# EAGLE design A-14732-40023-REPRODUCTION (EAGLE 7.4.0)

## Sheet 1 of 4
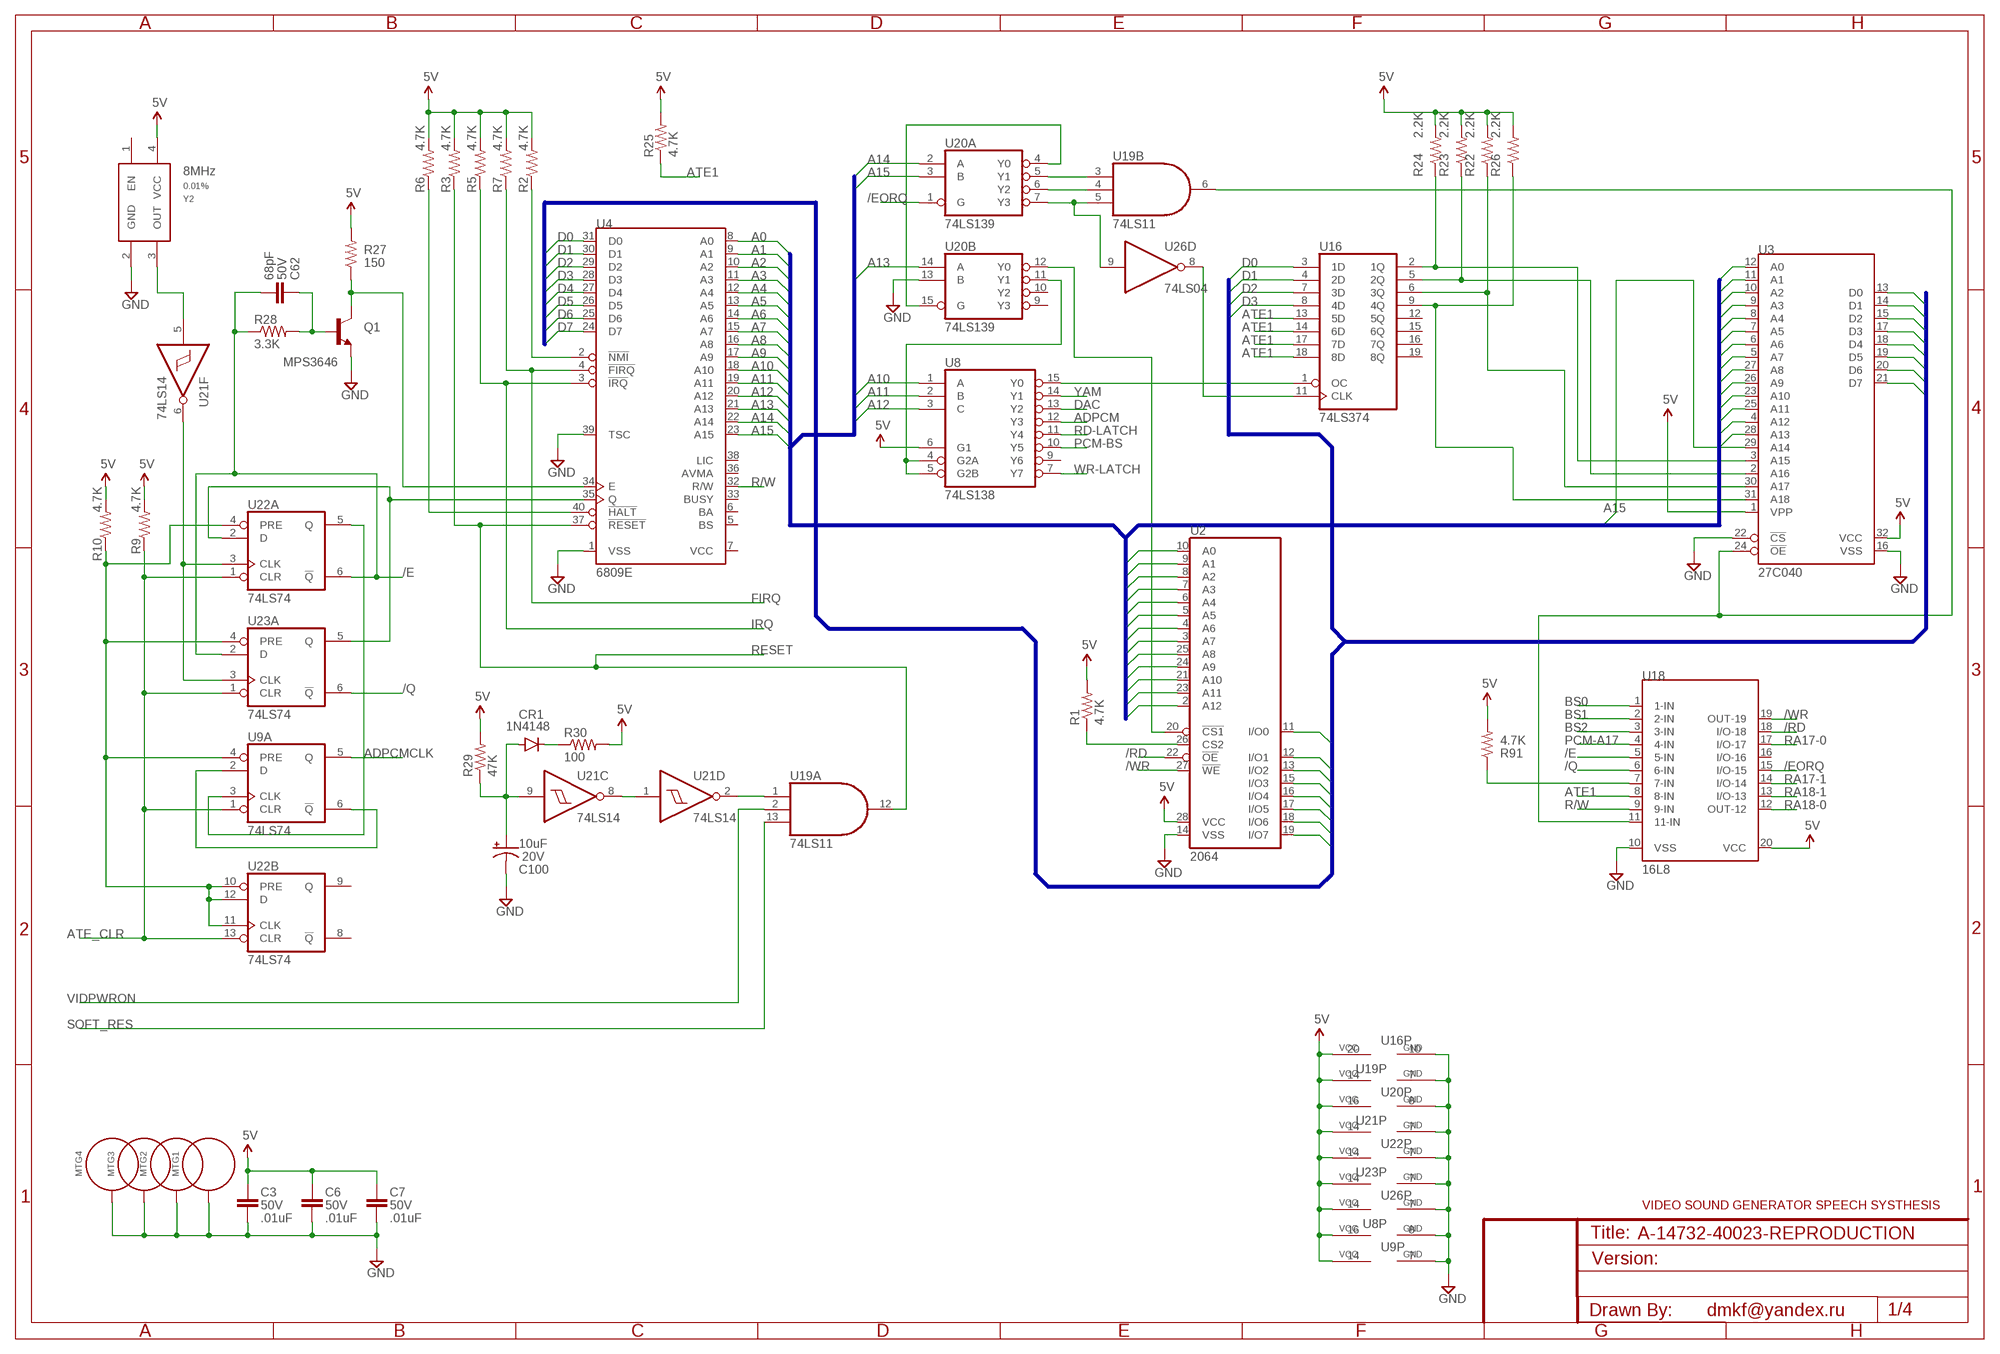
[diagram p0: schematic, sheet 1]

### Parts
C3  .01uF  CAP0805  [0805]
C6  .01uF  CAP0805  [0805]
C7  .01uF  CAP0805  [0805]
C62  68pF  CAP0805  [0805]
C100  10uF  CAP_POLC  [PANASONIC_C]
CR1  1N4148  DIODESMA  [SMA-DIODE]
MTG1  MTGHOLE  STANDOFF_ELECTRICAL  [STANDOFF-ELECTRICAL]
MTG2  MTGHOLE  STANDOFF_ELECTRICAL  [STANDOFF-ELECTRICAL]
MTG3  MTGHOLE  STANDOFF_ELECTRICAL  [STANDOFF-ELECTRICAL]
MTG4  MTGHOLE  STANDOFF_ELECTRICAL  [STANDOFF-ELECTRICAL]
Q1  MPS3646  TRANSISTOR_NPNMMBT2222A  [SOT23-3]
R1  4.7K  RESISTOR0805-RES  [0805]
R2  4.7K  RESISTOR0805-RES  [0805]
R3  4.7K  RESISTOR0805-RES  [0805]
R5  4.7K  RESISTOR0805-RES  [0805]
R6  4.7K  RESISTOR0805-RES  [0805]
R7  4.7K  RESISTOR0805-RES  [0805]
R9  4.7K  RESISTOR0805-RES  [0805]
R10  4.7K  RESISTOR0805-RES  [0805]
R22  2.2K  RESISTOR0805-RES  [0805]
R23  2.2K  RESISTOR0805-RES  [0805]
R24  2.2K  RESISTOR0805-RES  [0805]
R25  4.7K  RESISTOR0805-RES  [0805]
R26  2.2K  RESISTOR0805-RES  [0805]
R27  150  RESISTOR1206  [1206]
R28  3.3K  RESISTOR0805-RES  [0805]
R29  47K  RESISTOR0805-RES  [0805]
R30  100  RESISTOR1206  [1206]
R91  4.7K  RESISTOR0805-RES  [0805]
U2  2064  MS6264LSOP28  [SOP28]
U3  27C040  27C040PLCC32  [PLCC32R]
U4  6809E  [DIP40]
U8  74LS138  74LS138D  [SO16]
U9  74LS74  74LS74D  [SO14]
U16  74LS374  74LS374DW  [SO20W]
U18  16L8  PAL16L8  [DIP20N]
U19  74LS11  74LS11D  [SO14]
U20  74LS139  74LS139D  [SO16]
U21  74LS14  74LS14D  [SO14]
U22  74LS74  74LS74D  [SO14]
U23  74LS74  74LS74D  [SO14]
U26  74LS04  74LS04D  [SO14]
Y2  8MHz  OSCILLATOR5X3-PIN1-INDICATED  [CRYSTAL-OSC-SMD-5X3]

### Nets
5V: C3.1 C6.1 C7.1 R1.2 R2.2 R3.2 R5.2 R6.2 R7.2 R9.2 R10.2 R22.2 R23.2 R24.2 R25.2 R26.2 R27.2 R29.2 R30.2 R91.2 U2.28(VCC) U3.1(VPP) U3.32(VCC) U8.6(G1) U8.16(VCC) U9.14(P:VCC) U16.20(VCC) U18.20(VCC) U19.14(P:VCC) U20.16(P:VCC) U21.14(P:VCC) U22.14(P:VCC) U23.14(P:VCC) U26.14(P:VCC) Y2.4(VCC) ; also sheet 2,3,4
/E: C62.1 R28.1 U18.5(5-IN) U22.6(A:!Q) U23.2(A:D)
/EORQ: U18.15(I/O-15) U20.1(A:G)
/Q: U18.6(6-IN) U23.6(A:!Q)
/RD: U2.22(!OE) U18.18(I/O-18) ; also sheet 2
/WR: U2.27(!WE) U18.19(OUT-19) ; also sheet 2
A0: U2.10(A0) U3.12(A0) U4.8(A0) ; also sheet 2
A1: U2.9(A1) U3.11(A1) U4.9(A1)
A2: U2.8(A2) U3.10(A2) U4.10(A2)
A3: U2.7(A3) U3.9(A3) U4.11(A3)
A4: U2.6(A4) U3.8(A4) U4.12(A4)
A5: U2.5(A5) U3.7(A5) U4.13(A5)
A6: U2.4(A6) U3.6(A6) U4.14(A6)
A7: U2.3(A7) U3.5(A7) U4.15(A7)
A8: U2.25(A8) U3.27(A8) U4.16(A8)
A9: U2.24(A9) U3.26(A9) U4.17(A9)
A10: U2.21(A10) U3.23(A10) U4.18(A10) U8.1(A)
A11: U2.23(A11) U3.25(A11) U4.19(A11) U8.2(B)
A12: U2.2(A12) U3.4(A12) U4.20(A12) U8.3(C)
A13: U3.28(A13) U4.21(A13) U20.14(B:A)
A14: U4.22(A14) U20.2(A:A)
A15: U3.29(A14) U4.23(A15) U20.3(A:B)
ADPCM: U8.12(Y3) ; also sheet 2
ADPCMCLK: U9.5(A:Q) ; also sheet 2
ATE1: R25.1 U16.13(5D) U16.14(6D) U16.17(7D) U16.18(8D) U18.8(8-IN) ; also sheet 2,4
ATE_CLR: R9.1 U9.1(A:CLR) U22.1(A:CLR) U22.13(B:CLR) U23.1(A:CLR) ; also sheet 2
BS0: U18.1(1-IN) ; also sheet 2
BS1: U18.2(2-IN) ; also sheet 2
BS2: U18.3(3-IN) ; also sheet 2
D0: U2.11(I/O0) U3.13(D0) U4.31(D0) U16.3(1D) ; also sheet 2,4
D1: U2.12(I/O1) U3.14(D1) U4.30(D1) U16.4(2D) ; also sheet 2,4
D2: U2.13(I/O2) U3.15(D2) U4.29(D2) U16.7(3D) ; also sheet 2,4
D3: U2.15(I/O3) U3.17(D3) U4.28(D3) U16.8(4D) ; also sheet 2,4
D4: U2.16(I/O4) U3.18(D4) U4.27(D4) ; also sheet 2,4
D5: U2.17(I/O5) U3.19(D5) U4.26(D5) ; also sheet 2,4
D6: U2.18(I/O6) U3.20(D6) U4.25(D6) ; also sheet 2,4
D7: U2.19(I/O7) U3.21(D7) U4.24(D7) ; also sheet 2,4
DAC: U8.13(Y2) ; also sheet 2
FIRQ: R7.1 U4.4(!FIRQ) ; also sheet 2
GND: C3.2 C6.2 C7.2 C100.- MTG1.P1 MTG2.P1 MTG3.P1 MTG4.P1 Q1.2(E) U2.14(VSS) U3.16(VSS) U3.22(!CS) U4.1(VSS) U4.39(TSC) U8.8(GND) U9.7(P:GND) U16.10(GND) U18.10(VSS) U19.7(P:GND) U20.8(P:GND) U20.13(B:B) U21.7(P:GND) U22.7(P:GND) U23.7(P:GND) U26.7(P:GND) Y2.2(GND) ; also sheet 2,3,4
IRQ: R5.1 U4.3(!IRQ) ; also sheet 4
N$1: U21.5(F:I) Y2.3(OUT)
N$2: U21.6(F:O) U22.3(A:CLK) U23.3(A:CLK)
N$3: C62.2 Q1.1(B) R28.2
N$4: U9.3(A:CLK) U22.5(A:Q)
N$5: U4.35(Q) U22.2(A:D) U23.5(A:Q)
N$6: U9.2(A:D) U9.6(A:!Q)
N$7: Q1.3(C) R27.1 U4.34(E)
N$8: R10.1 U9.4(A:PRE) U22.4(A:PRE) U22.10(B:PRE) U22.11(B:CLK) U22.12(B:D) U23.4(A:PRE)
N$9: R6.1 U4.40(!HALT)
N$10: U20.4(A:Y0) U20.15(B:G)
N$11: R2.1 U4.2(!NMI)
N$12: U8.4(G2A) U8.5(G2B) U20.11(B:Y1)
N$13: U19.3(B:I0) U20.5(A:Y1)
N$14: C100.+ CR1.A R29.1 U21.9(C:I)
N$15: CR1.C R30.1
N$16: U21.1(D:I) U21.8(C:O)
N$17: U19.4(B:I1) U20.6(A:Y2)
N$18: U19.5(B:I2) U20.7(A:Y3) U26.9(D:I)
N$19: U19.1(A:I0) U21.2(D:O)
N$20: U8.15(Y0) U16.1(OC)
N$21: U16.11(CLK) U26.8(D:O)
N$22: U2.20(!CS1) U20.12(B:Y0)
N$23: R1.1 U2.26(CS2)
N$24: U3.24(!OE) U18.11(11-IN) U19.6(B:O)
N$25: R24.1 U3.3(A15) U16.2(1Q)
N$26: R23.1 U3.2(A16) U16.5(2Q)
N$27: R22.1 U3.30(A17) U16.6(3Q)
N$29: R26.1 U3.31(A18) U16.9(4Q)
N$30: R91.1 U18.7(7-IN)
PCM-A17: U18.4(4-IN) ; also sheet 2
PCM-BS: U8.10(Y5) ; also sheet 2
R/W: U4.32(R/W) U18.9(9-IN)
RA17-0: U18.17(I/O-17) ; also sheet 2
RA17-1: U18.14(I/O-14) ; also sheet 2
RA18-0: U18.12(OUT-12) ; also sheet 2
RA18-1: U18.13(I/O-13) ; also sheet 2
RD-LATCH: U8.11(Y4) ; also sheet 4
RESET: R3.1 U4.37(!RESET) U19.12(A:O) ; also sheet 2
SOFT_RES: U19.13(A:I2) ; also sheet 4
VIDPWRON: U19.2(A:I1) ; also sheet 4
WR-LATCH: U8.7(Y7) ; also sheet 4
YAM: U8.14(Y1) ; also sheet 2
Unconnected: U4.5(BS) U4.6(BA) U4.7(VCC) U4.33(BUSY) U4.36(AVMA) U4.38(LIC) U8.9(Y6) U16.12(5Q) U16.15(6Q) U16.16(7Q) U16.19(8Q) U18.16(I/O-16) U20.9(B:Y3) U20.10(B:Y2) U21.3(E:I) U21.4(E:O) U21.10(B:O) U21.11(B:I) U21.12(A:O) U21.13(A:I) U22.8(B:!Q) U22.9(B:Q) Y2.1(EN)

### Buses
D[0..7]
A[0..15]

### Notes on the sheet
- VIDEO SOUND GENERATOR SPEECH SYSTHESIS
- dmkf@yandex.ru

## Sheet 2 of 4
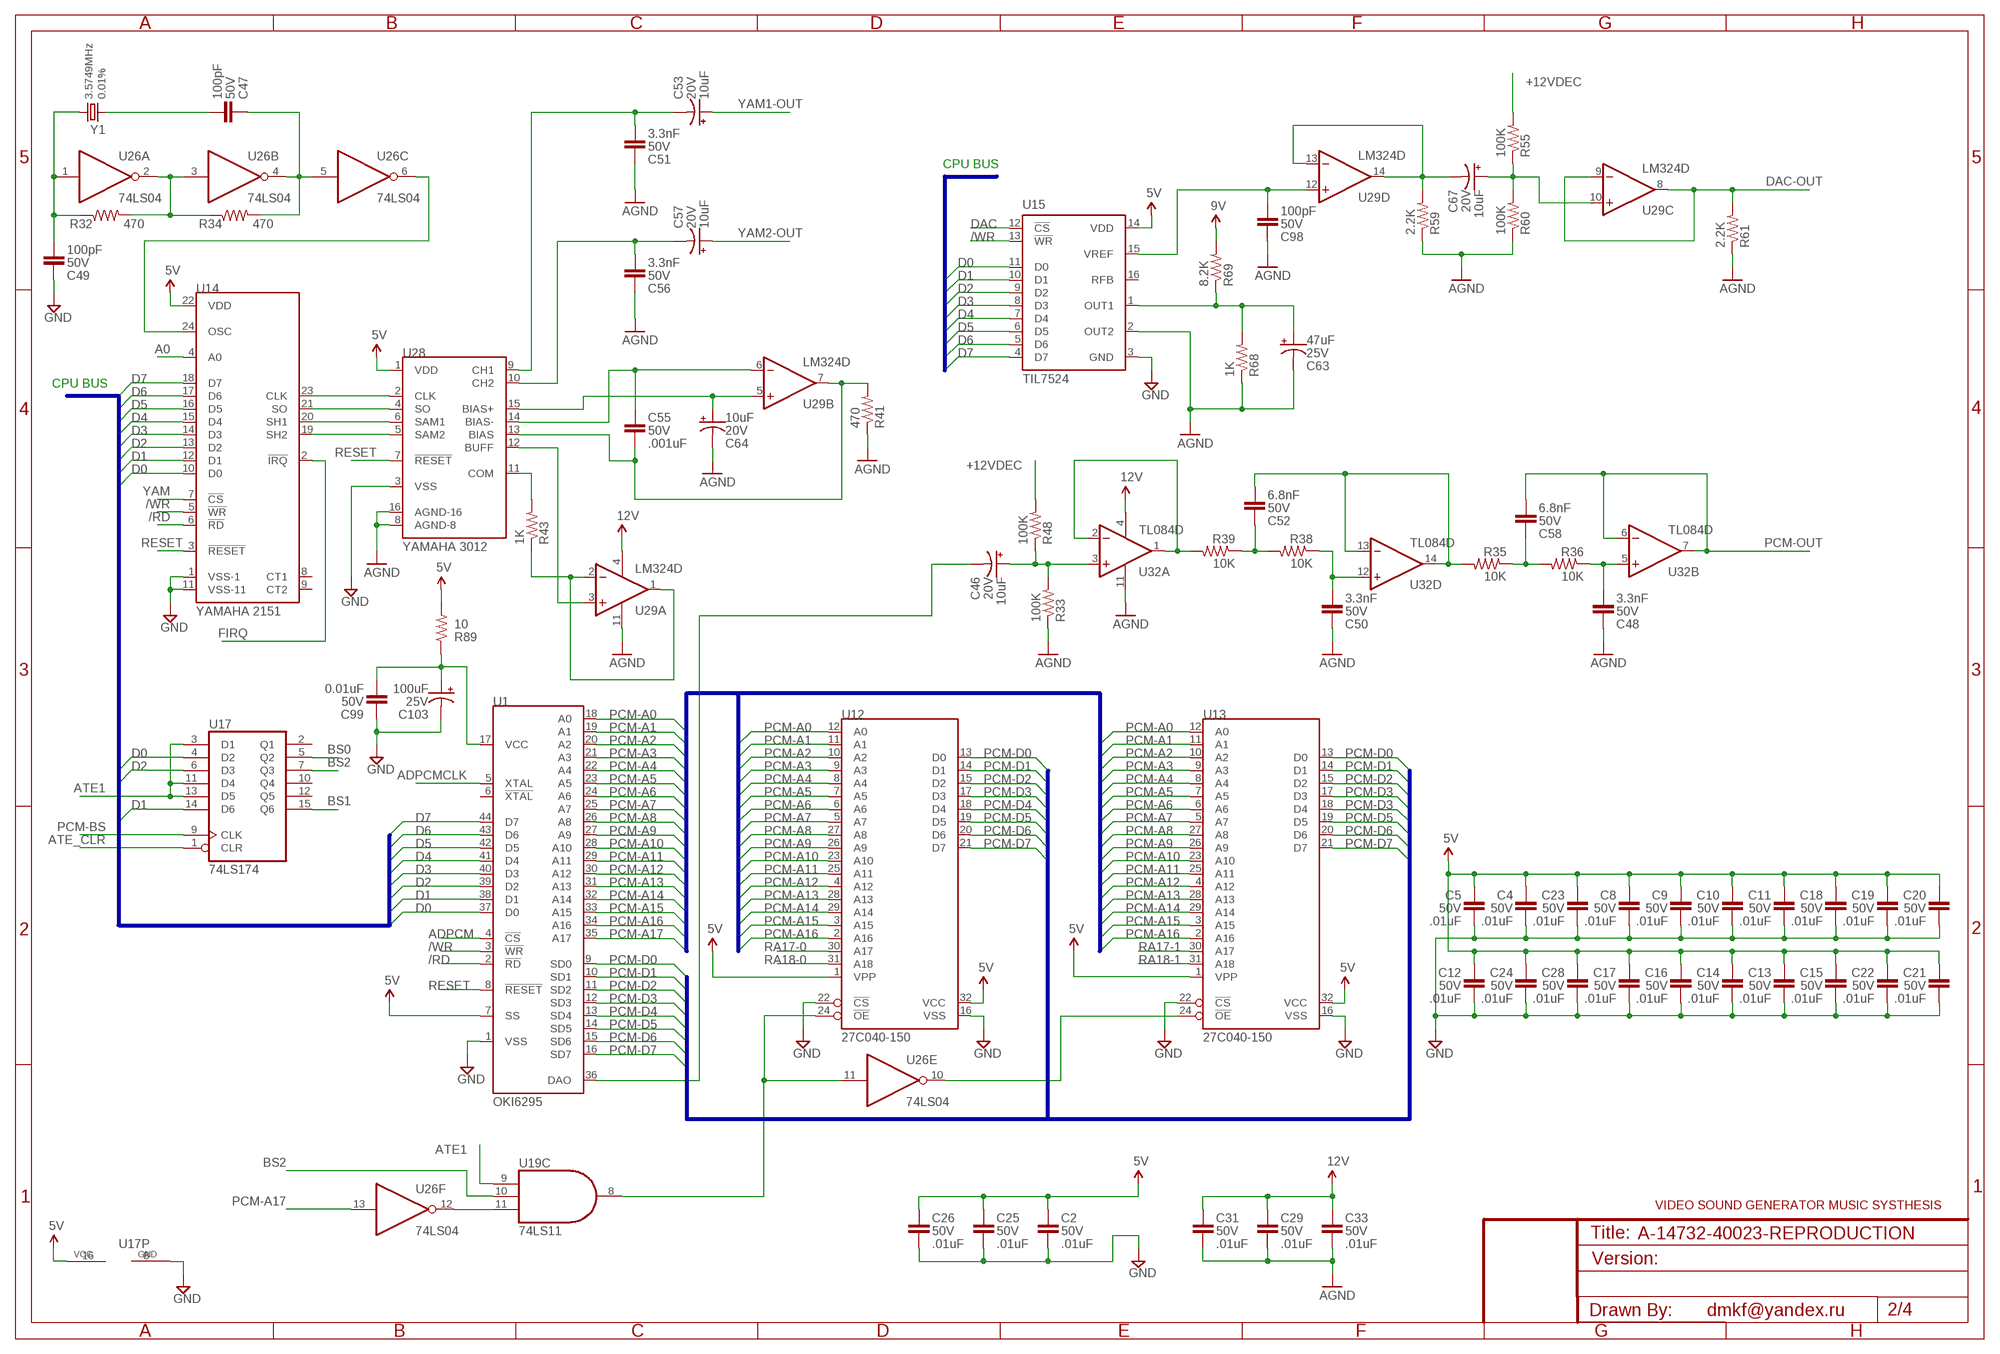
[diagram p1: schematic, sheet 2]

### Parts
C2  .01uF  CAP0805  [0805]
C4  .01uF  CAP0805  [0805]
C5  .01uF  CAP0805  [0805]
C8  .01uF  CAP0805  [0805]
C9  .01uF  CAP0805  [0805]
C10  .01uF  CAP0805  [0805]
C11  .01uF  CAP0805  [0805]
C12  .01uF  CAP0805  [0805]
C13  .01uF  CAP0805  [0805]
C14  .01uF  CAP0805  [0805]
C15  .01uF  CAP0805  [0805]
C16  .01uF  CAP0805  [0805]
C17  .01uF  CAP0805  [0805]
C18  .01uF  CAP0805  [0805]
C19  .01uF  CAP0805  [0805]
C20  .01uF  CAP0805  [0805]
C21  .01uF  CAP0805  [0805]
C22  .01uF  CAP0805  [0805]
C23  .01uF  CAP0805  [0805]
C24  .01uF  CAP0805  [0805]
C25  .01uF  CAP0805  [0805]
C26  .01uF  CAP0805  [0805]
C28  .01uF  CAP0805  [0805]
C29  .01uF  CAP0805  [0805]
C31  .01uF  CAP0805  [0805]
C33  .01uF  CAP0805  [0805]
C46  10uF  CAP_POLC  [PANASONIC_C]
C47  100pF  CAP0805  [0805]
C48  3.3nF  CAP0805  [0805]
C49  100pF  CAP0805  [0805]
C50  3.3nF  CAP0805  [0805]
C51  3.3nF  CAP0805  [0805]
C52  6.8nF  CAP0805  [0805]
C53  10uF  CAP_POLC  [PANASONIC_C]
C55  .001uF  CAP0805  [0805]
C56  3.3nF  CAP0805  [0805]
C57  10uF  CAP_POLC  [PANASONIC_C]
C58  6.8nF  CAP0805  [0805]
C63  47uF  CAP_POLD  [PANASONIC_D]
C64  10uF  CAP_POLC  [PANASONIC_C]
C67  10uF  CAP_POLC  [PANASONIC_C]
C98  100pF  CAP0805  [0805]
C99  0.01uF  CAP0805  [0805]
C103  100uF  CAP_POLD  [PANASONIC_D]
R32  470  RESISTOR0805-RES  [0805]
R33  100K  RESISTOR0805-RES  [0805]
R34  470  RESISTOR0805-RES  [0805]
R35  10K  RESISTOR0805-RES  [0805]
R36  10K  RESISTOR0805-RES  [0805]
R38  10K  RESISTOR0805-RES  [0805]
R39  10K  RESISTOR0805-RES  [0805]
R41  470  RESISTOR0805-RES  [0805]
R43  1K  RESISTOR0805-RES  [0805]
R48  100K  RESISTOR0805-RES  [0805]
R55  100K  RESISTOR0805-RES  [0805]
R59  2.2K  RESISTOR0805-RES  [0805]
R60  100K  RESISTOR0805-RES  [0805]
R61  2.2K  RESISTOR0805-RES  [0805]
R68  1K  RESISTOR0805-RES  [0805]
R69  8.2K  RESISTOR0805-RES  [0805]
R89  10  RESISTOR1206  [1206]
U1  OKI6295  [QFP44]
U12  27C040-150  27C040PLCC32  [PLCC32R]
U13  27C040-150  27C040PLCC32  [PLCC32R]
U14  YAMAHA 2151  YM2151  [DIP24]
U15  TIL7524  AD7524JR  [SOIC16N]
U17  74LS174  74LS174D  [SO16]
U28  YAMAHA 3012  YM3012  [DIP16N]
U29  LM324D  [SO14]
U32  TL084D  [SO14]
Y1  3.5749MHz  CRYSTALHC49U-V  [HC49U-V]

### Nets
5V: C2.1 C4.1 C5.1 C8.1 C9.1 C10.1 C11.1 C12.1 C13.1 C14.1 C15.1 C16.1 C17.1 C18.1 C19.1 C20.1 C21.1 C22.1 C23.1 C24.1 C25.1 C26.1 C28.1 R69.2 R89.2 U1.7(SS) U12.1(VPP) U12.32(VCC) U13.1(VPP) U13.32(VCC) U14.22(VDD) U15.14(VDD) U17.16(VCC) U28.1(VDD) ; supply symbol labelled 9V ; also sheet 1,3,4
12V: C29.1 C31.1 C33.1 U29.4(P:V+) U32.4(P:V+) ; also sheet 3
+12VDEC: R48.2 R55.2 ; also sheet 3
/RD: U1.2(!RD) U14.6(!RD) ; also sheet 1
/WR: U1.3(!WR) U14.5(!WR) U15.13(!WR) ; also sheet 1
A0: U14.4(A0) ; also sheet 1
ADPCM: U1.4(!CS) ; also sheet 1
ADPCMCLK: U1.5(XTAL) ; also sheet 1
AGND: C29.2 C31.2 C33.2 C48.2 C50.2 C51.2 C56.2 C63.- C64.- C98.2 R33.1 R41.1 R59.1 R60.1 R61.1 R68.1 U15.2(OUT2) U28.8(AGND-8) U28.16(AGND-16) U29.11(P:V-) U32.11(P:V-) ; also sheet 3
ATE1: U17.3(D1) U17.11(D4) U17.13(D5) U19.9(C:I0) ; also sheet 1,4
ATE_CLR: U17.1(CLR) ; also sheet 1
BS0: U17.5(Q2) ; also sheet 1
BS1: U17.15(Q6) ; also sheet 1
BS2: U17.7(Q3) U19.10(C:I1) ; also sheet 1
D0: U1.37(D0) U14.10(D0) U15.11(D0) U17.4(D2) ; also sheet 1,4
D1: U1.38(D1) U14.12(D1) U15.10(D1) U17.14(D6) ; also sheet 1,4
D2: U1.39(D2) U14.13(D2) U15.9(D2) U17.6(D3) ; also sheet 1,4
D3: U1.40(D3) U14.14(D3) U15.8(D3) ; also sheet 1,4
D4: U1.41(D4) U14.15(D4) U15.7(D4) ; also sheet 1,4
D5: U1.42(D5) U14.16(D5) U15.6(D5) ; also sheet 1,4
D6: U1.43(D6) U14.17(D6) U15.5(D6) ; also sheet 1,4
D7: U1.44(D7) U14.18(D7) U15.4(D7) ; also sheet 1,4
DAC: U15.12(!CS) ; also sheet 1
DAC-OUT: R61.2 U29.8(C:OUT) U29.9(C:-IN) ; also sheet 3
FIRQ: U14.2(!IRQ) ; also sheet 1
GND: C2.2 C4.2 C5.2 C8.2 C9.2 C10.2 C11.2 C12.2 C13.2 C14.2 C15.2 C16.2 C17.2 C18.2 C19.2 C20.2 C21.2 C22.2 C23.2 C24.2 C25.2 C26.2 C28.2 C49.2 C99.2 C103.- U1.1(VSS) U12.16(VSS) U12.22(!CS) U13.16(VSS) U13.22(!CS) U14.1(VSS-1) U14.11(VSS-11) U15.3(GND) U17.8(GND) U28.3(VSS) ; also sheet 1,3,4
N$34: C49.1 R32.1 U26.1(A:I) Y1.1
N$35: R32.2 R34.1 U26.2(A:O) U26.3(B:I)
N$36: C47.2 R34.2 U26.4(B:O) U26.5(C:I)
N$37: C47.1 Y1.2
N$38: U14.24(OSC) U26.6(C:O)
N$40: U14.23(CLK) U28.2(CLK)
N$41: U14.21(SO) U28.4(SO)
N$42: U14.20(SH1) U28.6(SAM1)
N$43: U14.19(SH2) U28.5(SAM2)
N$44: C99.1 C103.+ R89.1 U1.17(VCC)
N$45: U19.11(C:I2) U26.12(F:O)
N$46: U12.24(!OE) U19.8(C:O) U26.11(E:I)
N$47: U13.24(!OE) U26.10(E:O)
N$48: C46.- U1.36(DAO)
N$49: C51.1 C53.- U28.9(CH1)
N$50: C56.1 C57.- U28.10(CH2)
N$51: R43.1 U29.1(A:OUT) U29.2(A:-IN)
N$52: R43.2 U28.11(COM)
N$53: U28.12(BUFF) U29.3(A:+IN)
N$54: C55.2 R41.2 U28.13(BIAS) U29.7(B:OUT)
N$55: C55.1 U28.14(BIAS-) U29.6(B:-IN)
N$56: C63.+ R68.2 R69.1 U15.1(OUT1)
N$57: C64.+ U28.15(BIAS+) U29.5(B:+IN)
N$58: C98.1 U15.15(VREF) U29.12(D:+IN)
N$59: C67.- R59.2 U29.13(D:-IN) U29.14(D:OUT)
N$60: C67.+ R55.1 R60.2 U29.10(C:+IN)
N$61: C46.+ R33.2 R48.1 U32.3(A:+IN)
N$62: R39.2 U32.1(A:OUT) U32.2(A:-IN)
N$63: C52.2 R38.2 R39.1
N$64: C52.1 R35.2 U32.13(D:-IN) U32.14(D:OUT)
N$65: C50.1 R38.1 U32.12(D:+IN)
N$66: C58.2 R35.1 R36.2
N$67: C48.1 R36.1 U32.5(B:+IN)
PCM-A0: U1.18(A0) U12.12(A0) U13.12(A0)
PCM-A1: U1.19(A1) U12.11(A1) U13.11(A1)
PCM-A2: U1.20(A2) U12.10(A2) U13.10(A2)
PCM-A3: U1.21(A3) U12.9(A3) U13.9(A3)
PCM-A4: U1.22(A4) U12.8(A4) U13.8(A4)
PCM-A5: U1.23(A5) U12.7(A5) U13.7(A5)
PCM-A6: U1.24(A6) U12.6(A6) U13.6(A6)
PCM-A7: U1.25(A7) U12.5(A7) U13.5(A7)
PCM-A8: U1.26(A8) U12.27(A8) U13.27(A8)
PCM-A9: U1.27(A9) U12.26(A9) U13.26(A9)
PCM-A10: U1.28(A10) U12.23(A10) U13.23(A10)
PCM-A11: U1.29(A11) U12.25(A11) U13.25(A11)
PCM-A12: U1.30(A12) U12.4(A12) U13.4(A12)
PCM-A13: U1.31(A13) U12.28(A13) U13.28(A13)
PCM-A14: U1.32(A14) U12.29(A14) U13.29(A14)
PCM-A15: U1.33(A15) U12.3(A15) U13.3(A15)
PCM-A16: U1.34(A16) U12.2(A16) U13.2(A16)
PCM-A17: U1.35(A17) U26.13(F:I) ; also sheet 1
PCM-BS: U17.9(CLK) ; also sheet 1
PCM-D0: U1.9(SD0) U12.13(D0) U13.13(D0)
PCM-D1: U1.10(SD1) U12.14(D1) U13.14(D1)
PCM-D2: U1.11(SD2) U12.15(D2) U13.15(D2)
PCM-D3: U1.12(SD3) U12.17(D3) U13.17(D3) U13.18(D4)
PCM-D4: U1.13(SD4) U12.18(D4)
PCM-D5: U1.14(SD5) U12.19(D5) U13.19(D5)
PCM-D6: U1.15(SD6) U12.20(D6) U13.20(D6)
PCM-D7: U1.16(SD7) U12.21(D7) U13.21(D7)
PCM-OUT: C58.1 U32.6(B:-IN) U32.7(B:OUT) ; also sheet 3
RA17-0: U12.30(A17) ; also sheet 1
RA17-1: U13.30(A17) ; also sheet 1
RA18-0: U12.31(A18) ; also sheet 1
RA18-1: U13.31(A18) ; also sheet 1
RESET: U1.8(!RESET) U14.3(!RESET) U28.7(!RESET) ; also sheet 1
YAM: U14.7(!CS) ; also sheet 1
YAM1-OUT: C53.+ ; also sheet 3
YAM2-OUT: C57.+ ; also sheet 3
Unconnected: U1.6(!XTAL) U14.8(CT1) U14.9(CT2) U15.16(RFB) U17.2(Q1) U17.10(Q4) U17.12(Q5)

### Buses
D[0..7]
PCM-D[0..7]
PCM-A[0..17]

### Notes on the sheet
- CPU BUS
- CPU BUS
- VIDEO SOUND GENERATOR MUSIC SYSTHESIS
- dmkf@yandex.ru

## Sheet 3 of 4
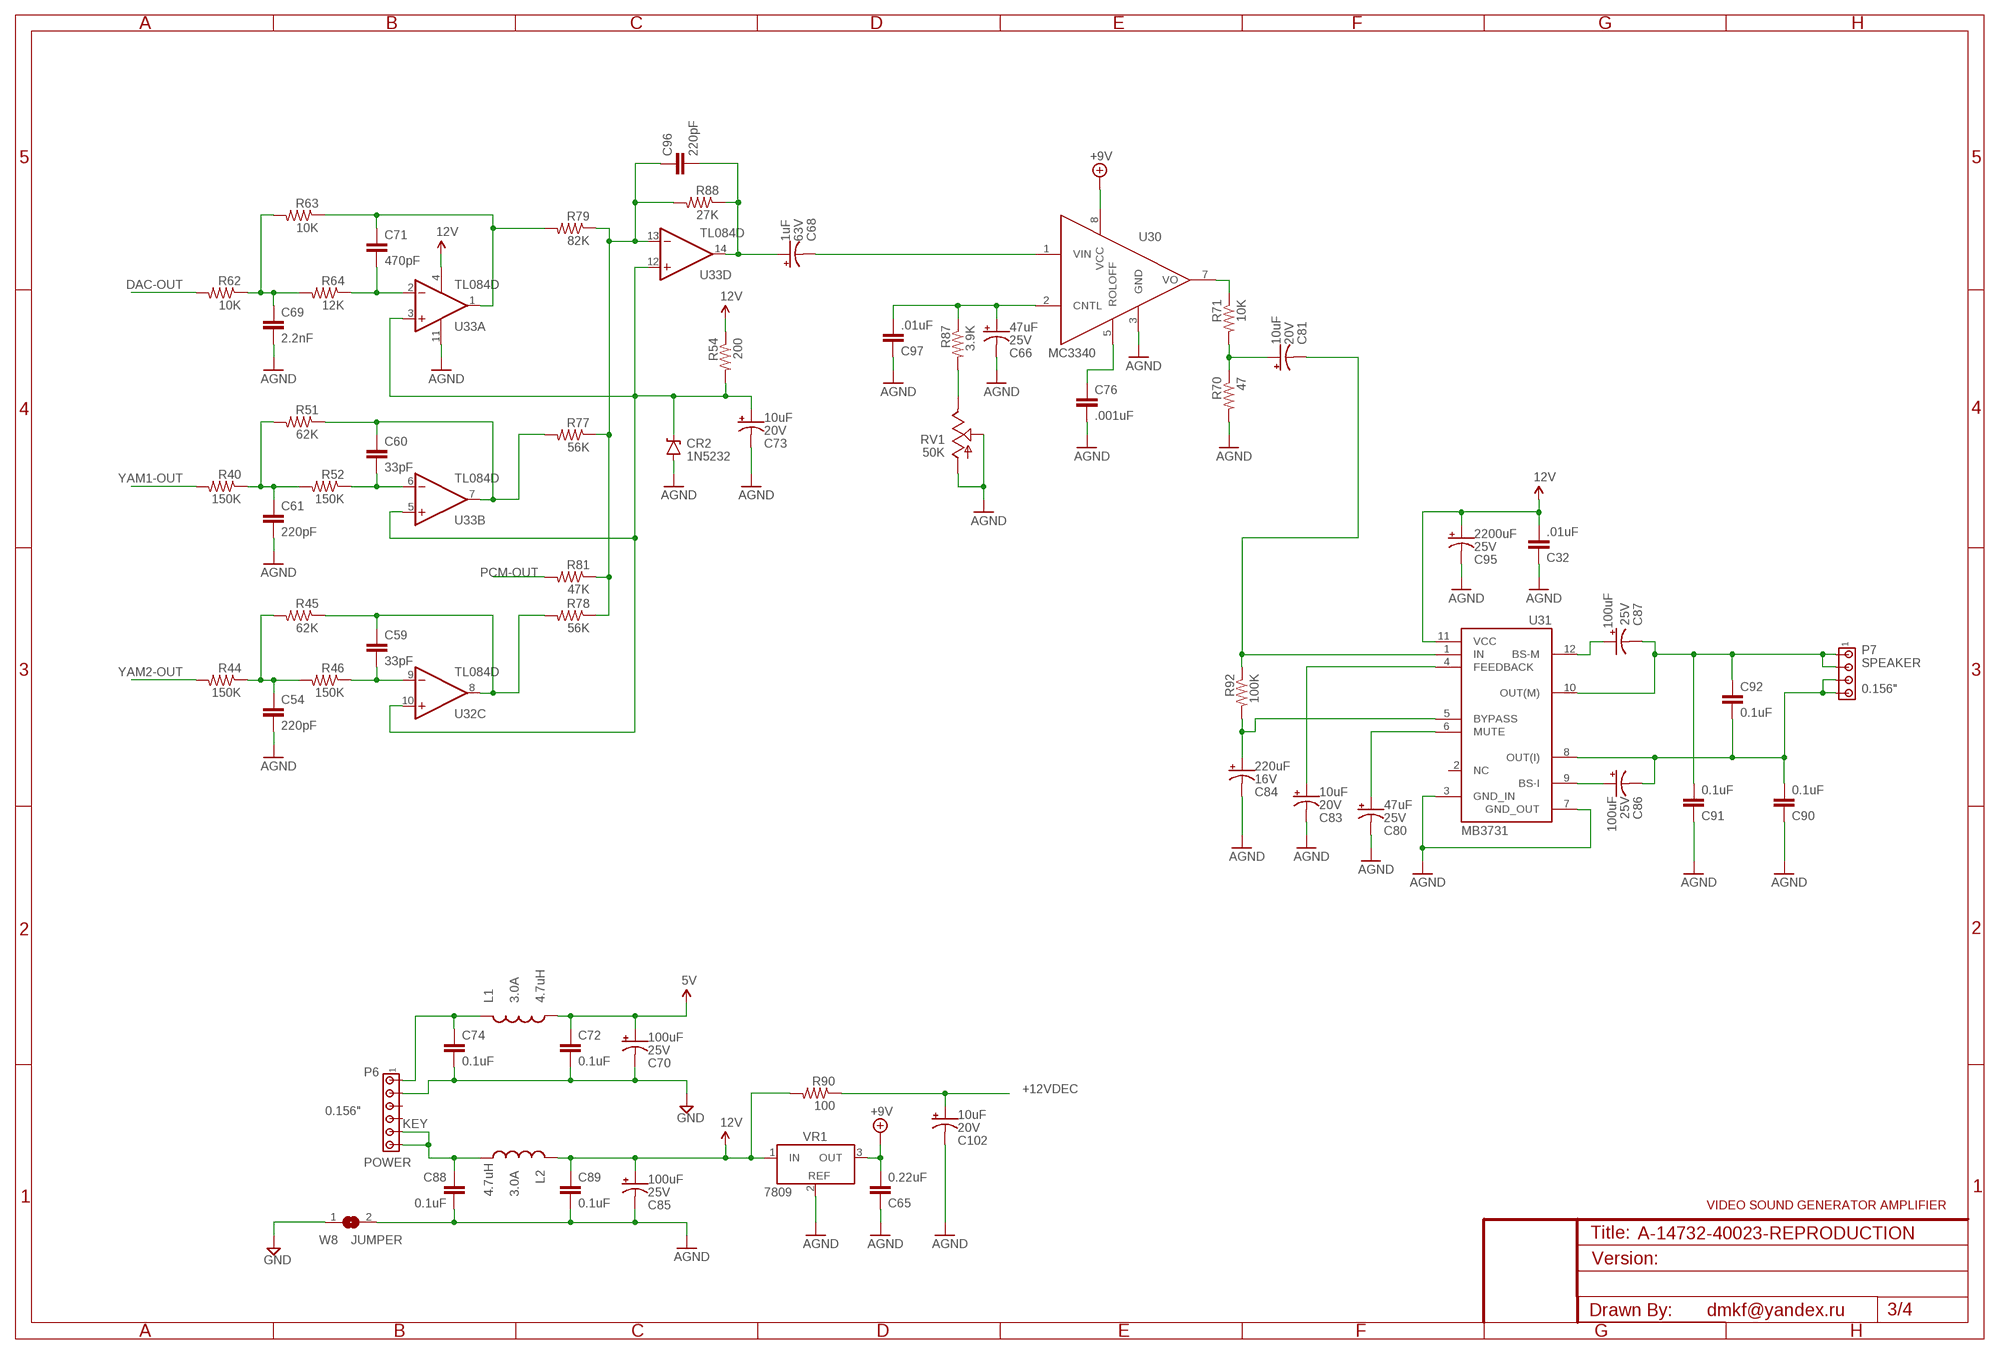
[diagram p2: schematic, sheet 3]

### Parts
C32  .01uF  CAP0805  [0805]
C54  220pF  CAP0805  [0805]
C59  33pF  CAP0805  [0805]
C60  33pF  CAP0805  [0805]
C61  220pF  CAP0805  [0805]
C65  0.22uF  CAP0805  [0805]
C66  47uF  CAP_POLD  [PANASONIC_D]
C68  1uF  CAP_POLC  [PANASONIC_C]
C69  2.2nF  CAP0805  [0805]
C70  100uF  CAP_POLD  [PANASONIC_D]
C71  470pF  CAP0805  [0805]
C72  0.1uF  CAP0805  [0805]
C73  10uF  CAP_POLC  [PANASONIC_C]
C74  0.1uF  CAP0805  [0805]
C76  .001uF  CAP0805  [0805]
C80  47uF  CAP_POLD  [PANASONIC_D]
C81  10uF  CAP_POLC  [PANASONIC_C]
C83  10uF  CAP_POLC  [PANASONIC_C]
C84  220uF  CAP_POLE  [PANASONIC_E]
C85  100uF  CAP_POLD  [PANASONIC_D]
C86  100uF  CAP_POLD  [PANASONIC_D]
C87  100uF  CAP_POLD  [PANASONIC_D]
C88  0.1uF  CAP0805  [0805]
C89  0.1uF  CAP0805  [0805]
C90  0.1uF  CAP0805  [0805]
C91  0.1uF  CAP0805  [0805]
C92  0.1uF  CAP0805  [0805]
C95  2200uF  CAP_POLPTH4  [CPOL-RADIAL-1000UF-25V]
C96  220pF  CAP0805  [0805]
C97  .01uF  CAP0805  [0805]
C102  10uF  CAP_POLC  [PANASONIC_C]
CR2  1N5232  [SOT23]
L1  4.7uH  INDUCTORNPI75  [NPI75C]
L2  4.7uH  INDUCTORNPI75  [NPI75C]
P6  POWER  MTA06-156  [1X6MTA]
P7  SPEAKER  MTA04-156  [1X4MTA]
R40  150K  RESISTOR0805-RES  [0805]
R44  150K  RESISTOR0805-RES  [0805]
R45  62K  RESISTOR0805-RES  [0805]
R46  150K  RESISTOR0805-RES  [0805]
R51  62K  RESISTOR0805-RES  [0805]
R52  150K  RESISTOR0805-RES  [0805]
R54  200  R-US_R1206  [R1206]
R62  10K  RESISTOR0805-RES  [0805]
R63  10K  RESISTOR0805-RES  [0805]
R64  12K  RESISTOR0805-RES  [0805]
R70  47  R-US_R1206  [R1206]
R71  10K  RESISTOR0805-RES  [0805]
R77  56K  RESISTOR0805-RES  [0805]
R78  56K  RESISTOR0805-RES  [0805]
R79  82K  RESISTOR0805-RES  [0805]
R81  47K  RESISTOR0805-RES  [0805]
R87  3.9K  RESISTOR0805-RES  [0805]
R88  27K  RESISTOR0805-RES  [0805]
R90  100  R-US_R1206  [R1206]
R92  100K  RESISTOR0805-RES  [0805]
RV1  50K  POT-RV16AF-20  [POT_ALPHA_RV16AF-20]
U30  MC3340  [MC3340]
U31  MB3731  [SIP12]
U33  TL084D  [SO14]
VR1  7809  7809TO220  [7809-TO220V]
W8  JUMPER  SJ  [SJ]

### Nets
5V: C70.+ C72.1 L1.1 ; also sheet 1,2,4
12V: C32.2 C85.+ C89.1 C95.1(+) L2.2 R54.1 R90.2 U31.11(VCC) U33.4(P:V+) VR1.1(IN) ; also sheet 2
+9V: C65.2 U30.8(VCC) VR1.3(OUT)
+12VDEC: C102.+ R90.1 ; also sheet 2
AGND: C32.1 C54.2 C61.2 C65.1 C66.- C69.2 C73.- C76.2 C80.- C83.- C84.- C85.- C88.2 C89.2 C90.1 C91.1 C95.2(-) C97.1 C102.- CR2.1(A) R70.2 RV1.1(A) RV1.2(S) U30.3(GND) U31.3(GND_IN) U31.7(GND_OUT) U33.11(P:V-) VR1.2(REF) W8.2 ; also sheet 2
DAC-OUT: R62.2 ; also sheet 2
GND: C70.- C72.2 C74.2 P6.2 W8.1 ; also sheet 1,2,4
N$28: C73.+ CR2.3(C) R54.2 U32.10(C:+IN) U33.3(A:+IN) U33.5(B:+IN) U33.12(D:+IN)
N$31: C74.1 L1.2 P6.1
N$32: C68.- U30.1(VIN)
N$68: C69.1 R62.1 R63.2 R64.2
N$69: C71.2 R64.1 U33.2(A:-IN)
N$70: C71.1 R63.1 R79.2 U33.1(A:OUT)
N$71: C60.1 R51.1 R77.2 U33.7(B:OUT)
N$72: C61.1 R40.1 R51.2 R52.2
N$73: C60.2 R52.1 U33.6(B:-IN)
N$74: C96.1 R77.1 R78.1 R79.1 R81.1 R88.2 U33.13(D:-IN)
N$78: C54.1 R44.1 R45.2 R46.2
N$79: C59.1 R45.1 R78.2 U32.8(C:OUT)
N$80: C59.2 R46.1 U32.9(C:-IN)
N$81: C68.+ C96.2 R88.1 U33.14(D:OUT)
N$83: C88.1 L2.1 P6.5 P6.6
N$86: C66.+ C97.2 R87.1 U30.2(CNTL)
N$87: R87.2 RV1.3(E)
N$88: C76.1 U30.5(ROLOFF)
N$89: C81.+ R70.1 R71.2
N$90: R71.1 U30.7(VO)
N$91: C81.- R92.1 U31.1(IN)
N$92: C84.+ R92.2 U31.5(BYPASS)
N$93: C83.+ U31.4(FEEDBACK)
N$94: C80.+ U31.6(MUTE)
N$95: C87.+ U31.12(BS-M)
N$96: C86.+ U31.9(BS-I)
N$100: C87.- C91.2 C92.1 P7.1 P7.2 U31.10(OUT(M))
N$103: C86.- C90.2 C92.2 P7.3 P7.4 U31.8(OUT(I))
PCM-OUT: R81.2 ; also sheet 2
YAM1-OUT: R40.2 ; also sheet 2
YAM2-OUT: R44.2 ; also sheet 2
Unconnected: P6.3 P6.4 U31.2(NC) U33.8(C:OUT) U33.9(C:-IN) U33.10(C:+IN)

### Notes on the sheet
- VIDEO SOUND GENERATOR AMPLIFIER
- dmkf@yandex.ru

## Sheet 4 of 4
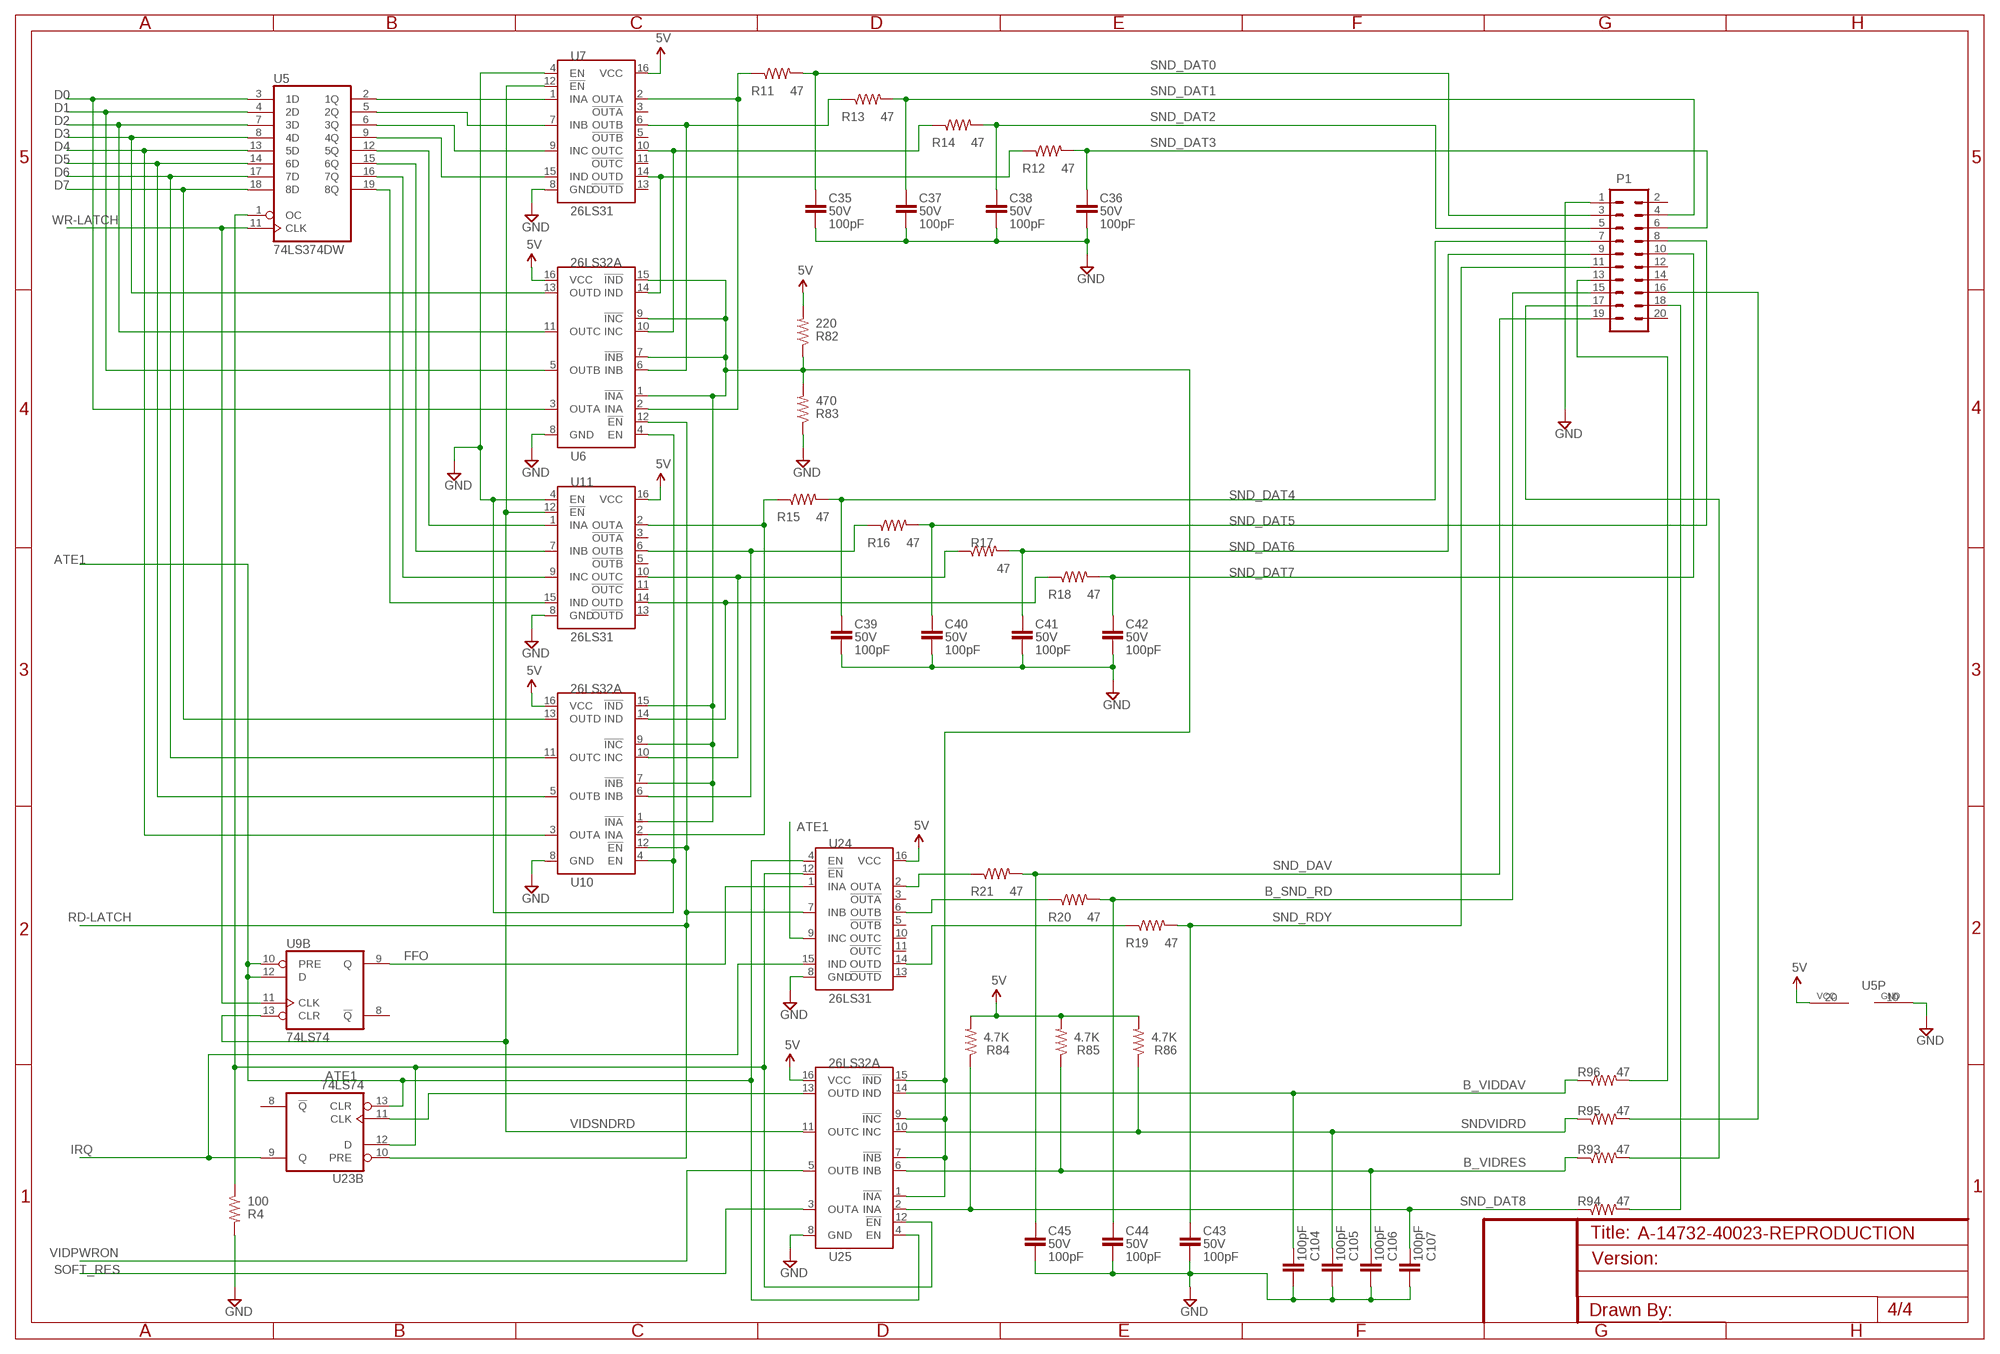
[diagram p3: schematic, sheet 4]

### Parts
C35  100pF  CAP0805  [0805]
C36  100pF  CAP0805  [0805]
C37  100pF  CAP0805  [0805]
C38  100pF  CAP0805  [0805]
C39  100pF  CAP0805  [0805]
C40  100pF  CAP0805  [0805]
C41  100pF  CAP0805  [0805]
C42  100pF  CAP0805  [0805]
C43  100pF  CAP0805  [0805]
C44  100pF  CAP0805  [0805]
C45  100pF  CAP0805  [0805]
C104  100pF  CAP0805  [0805]
C105  100pF  CAP0805  [0805]
C106  100pF  CAP0805  [0805]
C107  100pF  CAP0805  [0805]
P1  M10X2ROUND_NOSILK  [2X10_ROUND_NOSILK]
R4  100  RESISTOR0805-RES  [0805]
R11  47  RESISTOR0805-RES  [0805]
R12  47  RESISTOR0805-RES  [0805]
R13  47  RESISTOR0805-RES  [0805]
R14  47  RESISTOR0805-RES  [0805]
R15  47  R-US_R1206  [R1206]
R16  47  R-US_R1206  [R1206]
R17  47  R-US_R1206  [R1206]
R18  47  R-US_R1206  [R1206]
R19  47  RESISTOR0805-RES  [0805]
R20  47  RESISTOR0805-RES  [0805]
R21  47  RESISTOR0805-RES  [0805]
R82  220  R-US_R1206  [R1206]
R83  470  R-US_R1206  [R1206]
R84  4.7K  RESISTOR0805-RES  [0805]
R85  4.7K  RESISTOR0805-RES  [0805]
R86  4.7K  RESISTOR0805-RES  [0805]
R93  47  RESISTOR0805-RES  [0805]
R94  47  RESISTOR0805-RES  [0805]
R95  47  RESISTOR0805-RES  [0805]
R96  47  RESISTOR0805-RES  [0805]
U5  74LS374DW  [SO20W]
U6  26LS32A  [SO16]
U7  26LS31  [SO16]
U10  26LS32A  [SO16]
U11  26LS31  [SO16]
U24  26LS31  [SO16]
U25  26LS32A  [SO16]

### Nets
5V: R82.2 R84.2 R85.2 R86.2 U5.20(VCC) U6.16(VCC) U7.16(VCC) U10.16(VCC) U11.16(VCC) U24.16(VCC) U25.16(VCC) ; also sheet 1,2,3
ATE1: U9.10(B:PRE) U9.12(B:D) U23.13(B:CLR) U24.4(EN) U24.9(INC) U25.4(EN) ; also sheet 1,2
B_SND_RD: C44.1 P1.15 R20.2
B_VIDDAV: C104.2 R96.1 U25.14(IND)
B_VIDRES: C106.1 R85.1 R93.1 U25.6(INB)
D0: U5.3(1D) U6.3(OUTA) ; also sheet 1,2
D1: U5.4(2D) U6.5(OUTB) ; also sheet 1,2
D2: U5.7(3D) U6.11(OUTC) ; also sheet 1,2
D3: U5.8(4D) U6.13(OUTD) ; also sheet 1,2
D4: U5.13(5D) U10.3(OUTA) ; also sheet 1,2
D5: U5.14(6D) U10.5(OUTB) ; also sheet 1,2
D6: U5.17(7D) U10.11(OUTC) ; also sheet 1,2
D7: U5.18(8D) U10.13(OUTD) ; also sheet 1,2
FFO: U9.9(B:Q) U24.1(INA)
GND: C35.2 C36.2 C37.2 C38.2 C39.2 C40.2 C41.2 C42.2 C43.2 C44.2 C45.2 C104.1 C105.1 C106.2 C107.2 P1.1 R4.2 R83.1 U5.10(GND) U6.4(EN) U6.8(GND) U7.4(EN) U7.8(GND) U10.4(EN) U10.8(GND) U11.4(EN) U11.8(GND) U24.8(GND) U25.8(GND) ; also sheet 1,2,3
IRQ: U23.9(B:Q) U24.15(IND) ; also sheet 1
N$97: P1.13 R96.2
N$98: U5.2(1Q) U7.1(INA)
N$99: P1.16 R95.2
N$101: P1.17 R93.2
N$102: P1.18 R94.2
N$104: U5.5(2Q) U7.7(INB)
N$105: U5.6(3Q) U7.9(INC)
N$106: U5.9(4Q) U7.15(IND)
N$107: U5.12(5Q) U11.1(INA)
N$108: U5.15(6Q) U11.7(INB)
N$109: U5.16(7Q) U11.9(INC)
N$110: U5.19(8Q) U11.15(IND)
N$111: R21.1 U24.2(OUTA)
N$112: R15.1 U10.2(INA) U11.2(OUTA)
N$113: U23.11(B:CLK) U25.13(OUTD)
N$114: R4.1 U5.1(OC) U23.12(B:D) U24.12(!EN) U25.12(!EN)
N$115: R11.1 U6.2(INA) U7.2(OUTA)
N$116: R16.1 U10.6(INB) U11.6(OUTB)
N$117: R13.1 U6.6(INB) U7.6(OUTB)
N$118: R17.1 U10.10(INC) U11.10(OUTC)
N$119: R18.1 U10.14(IND) U11.14(OUTD)
N$120: R82.1 R83.2 U6.1(!INA) U6.7(!INB) U6.9(!INC) U6.15(!IND) U10.1(!INA) U10.7(!INB) U10.9(!INC) U10.15(!IND) U25.1(!INA) U25.7(!INB) U25.9(!INC) U25.15(!IND)
N$122: R14.1 U6.10(INC) U7.10(OUTC)
N$123: R12.1 U6.14(IND) U7.14(OUTD)
N$127: R20.1 U24.6(OUTB)
N$128: R19.1 U24.14(OUTD)
RD-LATCH: U6.12(!EN) U10.12(!EN) U23.10(B:PRE) U24.7(INB) ; also sheet 1
SND_DAT0: C35.1 P1.3 R11.2
SND_DAT1: C37.1 P1.4 R13.2
SND_DAT2: C38.1 P1.5 R14.2
SND_DAT3: C36.1 P1.6 R12.2
SND_DAT4: C39.1 P1.7 R15.2
SND_DAT5: C40.1 P1.8 R16.2
SND_DAT6: C41.1 P1.9 R17.2
SND_DAT7: C42.1 P1.10 R18.2
SND_DAT8: C107.1 R84.1 R94.1 U25.2(INA)
SND_DAV: C45.1 P1.19 R21.2
SND_RDY: C43.1 P1.11 R19.2
SNDVIDRD: C105.2 R86.1 R95.1 U25.10(INC)
SOFT_RES: U25.3(OUTA) ; also sheet 1
VIDPWRON: U25.5(OUTB) ; also sheet 1
VIDSNDRD: U7.12(!EN) U9.13(B:CLR) U11.12(!EN) U25.11(OUTC)
WR-LATCH: U5.11(CLK) U9.11(B:CLK) ; also sheet 1
Unconnected: P1.2 P1.12 P1.14 P1.20 U7.3(!OUTA) U7.5(!OUTB) U7.11(!OUTC) U7.13(!OUTD) U9.8(B:!Q) U11.3(!OUTA) U11.5(!OUTB) U11.11(!OUTC) U11.13(!OUTD) U23.8(B:!Q) U24.3(!OUTA) U24.5(!OUTB) U24.10(OUTC) U24.11(!OUTC) U24.13(!OUTD)

## Library data of the parts
C2-C26 C28 C29 C31-C33 C35-C45 C47-C52 C54-C56 C58-C61 C65 C69 C71 C72 C74 C76 C88-C92 C96-C99 C104-C107 = SparkFun-Passives:CAP: Capacitor Standard 0603 ceramic capacitor, and 0.1" leaded capacitor.; VOLTAGE: 50V
C46 C53 C57 C64 C67 C73 C81 C83 C100 C102 = A-14732-40023:CAP_POL: Capacitor Polarized These are standard SMD and PTH capacitors. Normally 10uF, 47uF, and 100uF in electrolytic and tantalum varieties. Always verify the external diameter of the through hole cap, it varies with capacity, voltage, and manufacturer. The EIA devices should be standard.; VOLTAGE: 20V
C62 = SparkFun-Passives:CAP: Capacitor Standard 0603 ceramic capacitor, and 0.1" leaded capacitor.
C63 C66 C70 C80 C85-C87 C95 C103 = A-14732-40023:CAP_POL: Capacitor Polarized These are standard SMD and PTH capacitors. Normally 10uF, 47uF, and 100uF in electrolytic and tantalum varieties. Always verify the external diameter of the through hole cap, it varies with capacity, voltage, and manufacturer. The EIA devices should be standard.; VOLTAGE: 25V
C68 = A-14732-40023:CAP_POL: Capacitor Polarized These are standard SMD and PTH capacitors. Normally 10uF, 47uF, and 100uF in electrolytic and tantalum varieties. Always verify the external diameter of the through hole cap, it varies with capacity, voltage, and manufacturer. The EIA devices should be standard.; VOLTAGE: 63V
C84 = A-14732-40023:CAP_POL: Capacitor Polarized These are standard SMD and PTH capacitors. Normally 10uF, 47uF, and 100uF in electrolytic and tantalum varieties. Always verify the external diameter of the through hole cap, it varies with capacity, voltage, and manufacturer. The EIA devices should be standard.; VOLTAGE: 16V
CR1 = SparkFun-DiscreteSemi:DIODE: Diode These are standard reverse protection diodes and small signal diodes. SMA package can handle up to about 1A. SOD-323 can handle about 200mA. What the SOD-323 package when ordering, there are some mfgs out there that are 5-pin packages.
CR2 = A-14732-40023:1N5232: Zener diode 5.6V 5%
L1 = SparkFun-Passives:INDUCTOR: Inductors Basic Inductor/Choke - 0603 and 1206. Footprints are not proven and vary greatly between part numbers. INDUCTOR POWER 3.3UH 4.0A SMD 0.197" L x 0.197" W x 0.177" H (5.00mm x 5.00mm x 4.50mm); CUR: 3.0A
L2 = SparkFun-Passives:INDUCTOR: Inductors Basic Inductor/Choke - 0603 and 1206. Footprints are not proven and vary greatly between part numbers. INDUCTOR POWER 3.3UH 4.0A SMD 0.197" L x 0.197" W x 0.177" H (5.00mm x 5.00mm x 4.50mm); CURRENT: 3.0A
MTG1-MTG4 = SparkFun-Electromechanical:STANDOFF_ELECTRICAL: A standoff intended to be an electrically connected point. Pad size and stop size allow for a #4 Phillips pan screw head to make a solid connection to the board.
P1 = SparkFun-Connectors:M10X2: This was SPECIALLY designed to be used with our Graphic LCD Backpack. Be sure you want to use this! It is not only staggered on each line of header holes, but IT IS ALSO offset of the center point of the top and bottom lines by 5 mil. This causes the headers to lock into place on the "standard" footprint on the LCD screen. The extra squares on the tdocu layer are there simply to reference other pins (if you were to actually populate a longer header than ten long - this is what we do with the backpacks).
P6 = con-amp:MTA06-156: AMP connector; PITCH: 0.156"
P7 = con-amp:MTA04-156: AMP connector; PITCH: 0.156"
Q1 = SparkFun-DiscreteSemi:TRANSISTOR_NPN: Generic NPN BJT MMBT2222A - TRANS-08049 (SOT-23, 1A 40V) MPSA42 - TRANS-09116 (SOT-23, 500mA 300V) MMBT5088LT1G - TRANS-11160 (SOT-23, 50 mA 30V) BC547 - COM-08928 <http://www.sparkfun.com/products/8928> (TO-92 45V 100mA) (1.Collector 2.Base 3.Emitter) 2N3904 - COM-00521 <http://www.sparkfun.com/products/521> (TO-92 40V 200mA) (1.Emitter 2.Base 3.Collector) P2N2222A - COM-12852 <http://www.sparkfun.com/products/12852> (TO-92 40V 600mA) (1.Collector 2.Base 3.Emitter); PROD_ID: TRANS-08049; VALUE: MMBT2222A
R1-R7 R9-R14 R19-R30 R32-R36 R38-R41 R43-R46 R48 R51 R52 R55 R59-R64 R68 R69 R71 R77-R79 R81 R84-R89 R91-R96 = SparkFun-Passives:RESISTOR: Resistor Basic schematic elements and footprints for 0603, 1206, and PTH resistors.
R15-R18 R54 R70 R82 R83 R90 = resistor:R-US_: RESISTOR, American symbol
RV1 = SparkFun-Electromechanical:POT
U1 = A-14732-40023:OKI6295: OKI MSM6295 4-channel mixing ADPCM voice synthesis LSI
U2 = A-14732-40023:MS6264L: Hitachi SRAM memory 8K x 8 in DIP28 or SOP28 (330mil) package
U3 U12 U13 = A-14732-40023:27C040: EPROM memory in DIP32 package
U4 = A-14732-40023:6809E: Motorola 6809E microprocessor in DIP40 package
U5 U16 = 74xx-us:74*374: Octal D type transparent LATCH, edge triggered
U6 U10 U25 = A-14732-40009:26LS32A: Quadruple Differential Line Receiver
U7 U11 U24 = A-14732-40009:26LS31: Quadruple Differential Line Driver
U8 = 74xx-us:74*138: 3-line to 8-line DECODER/DEMULTIPLEXER
U9 U22 U23 = 74xx-us:74*74: Dual D type positive edge triggered FLIP FLOP, preset and clear
U14 = A-14732-40023:YM2151: Yamaha 2151 FM-type sound generator in DIP24 package
U15 = analog-devices:AD7524*: 8-Bit Buffered Multiplying DAC Source: http://www.analog.com/UploadedFiles/Data_Sheets/888358036ad7524.pdf; MF: ALTERA CORPORATION; MPN: AD7524JRZ; OC_FARNELL: 1423882; OC_NEWARK: 59K4970
U17 = 74xx-us:74*174: Hex D type FLIP FLOP, clear
U18 = A-14732-40023:PAL16L8: PAL16TIB8 PLD in DIP20 package
U19 = 74xx-us:74*11: Triple 3-input AND gate
U20 = 74xx-us:74*139: Dual 2-line to 4-line DECODER/DEMULTIPLEXER
U21 = 74xx-us:74*14: Hex schmitt trigger INVERTER
U26 = 74xx-us:74*04: Hex INVERTER
U28 = A-14732-40023:YM3012: Yamaha 3012 2-channel serial input floating DAC
U29 = linear:LM324: OP AMP
U30 = MK-ICs:MC3340: Motorola electronic attenuator in DIP8 package
U31 = A-14732-40023:MB3731: Fujitsu MB3731 audio amplifier in SIP12 package
U32 U33 = linear:TL084: OP AMP
VR1 = MK-ICs:7809: Positive voltage regulator for 9V; PARTNUMBER: 5460-12743-00
W8 = jumper:SJ: SMD solder JUMPER
Y1 = crystal:CRYSTAL: CRYSTAL; OC_FARNELL: 1666969; OC_NEWARK: unknown; TOLERANCE: 0.01%
Y2 = SparkFun-FreqCtrl:OSCILLATOR: Generic 5x3 and 7x5 oscillators; TOLERANCE: 0.01%

## Board
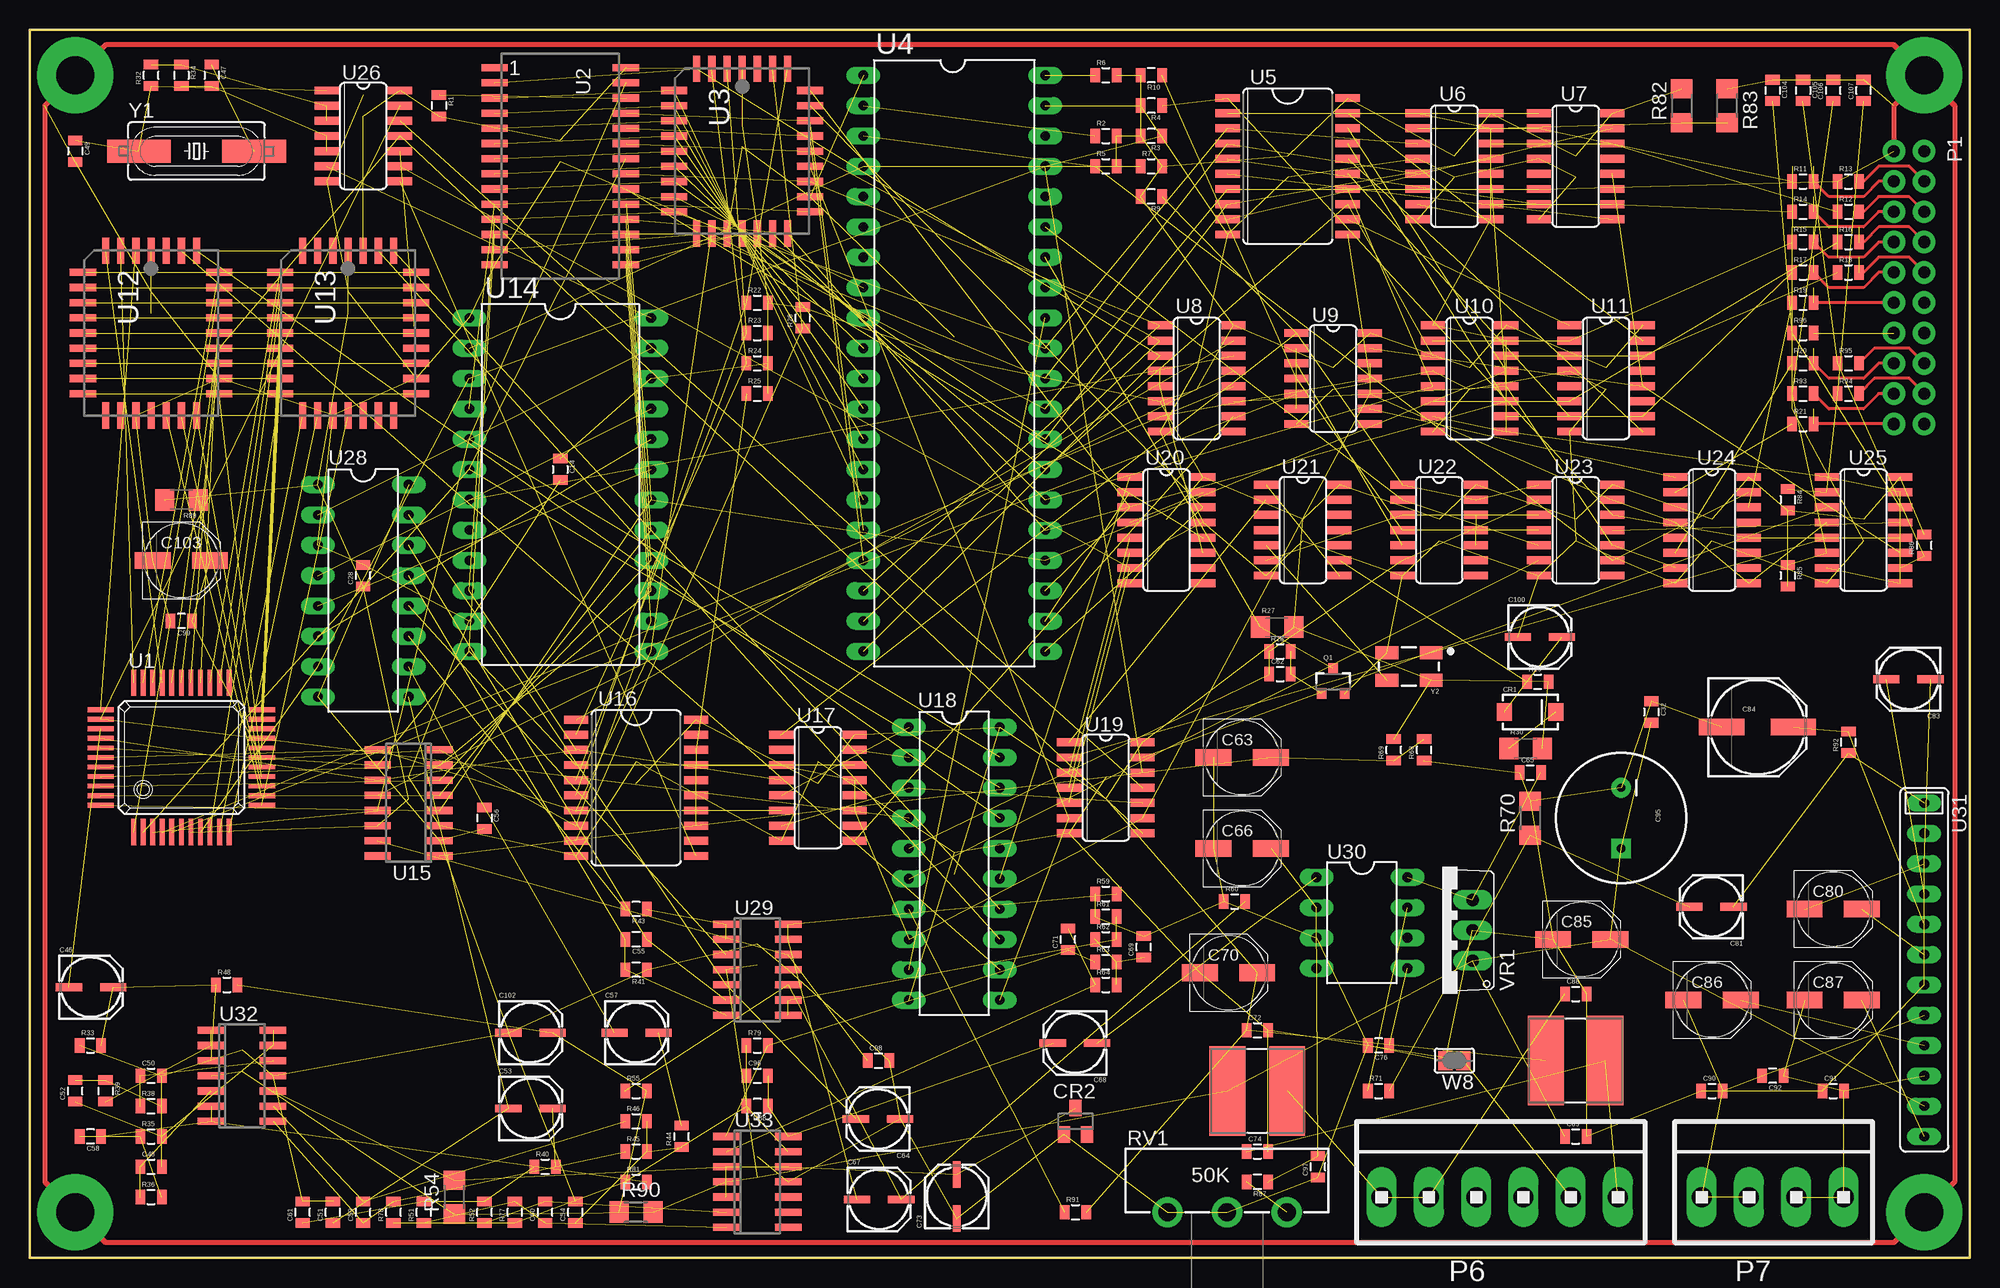
[diagram p4: board, top side]
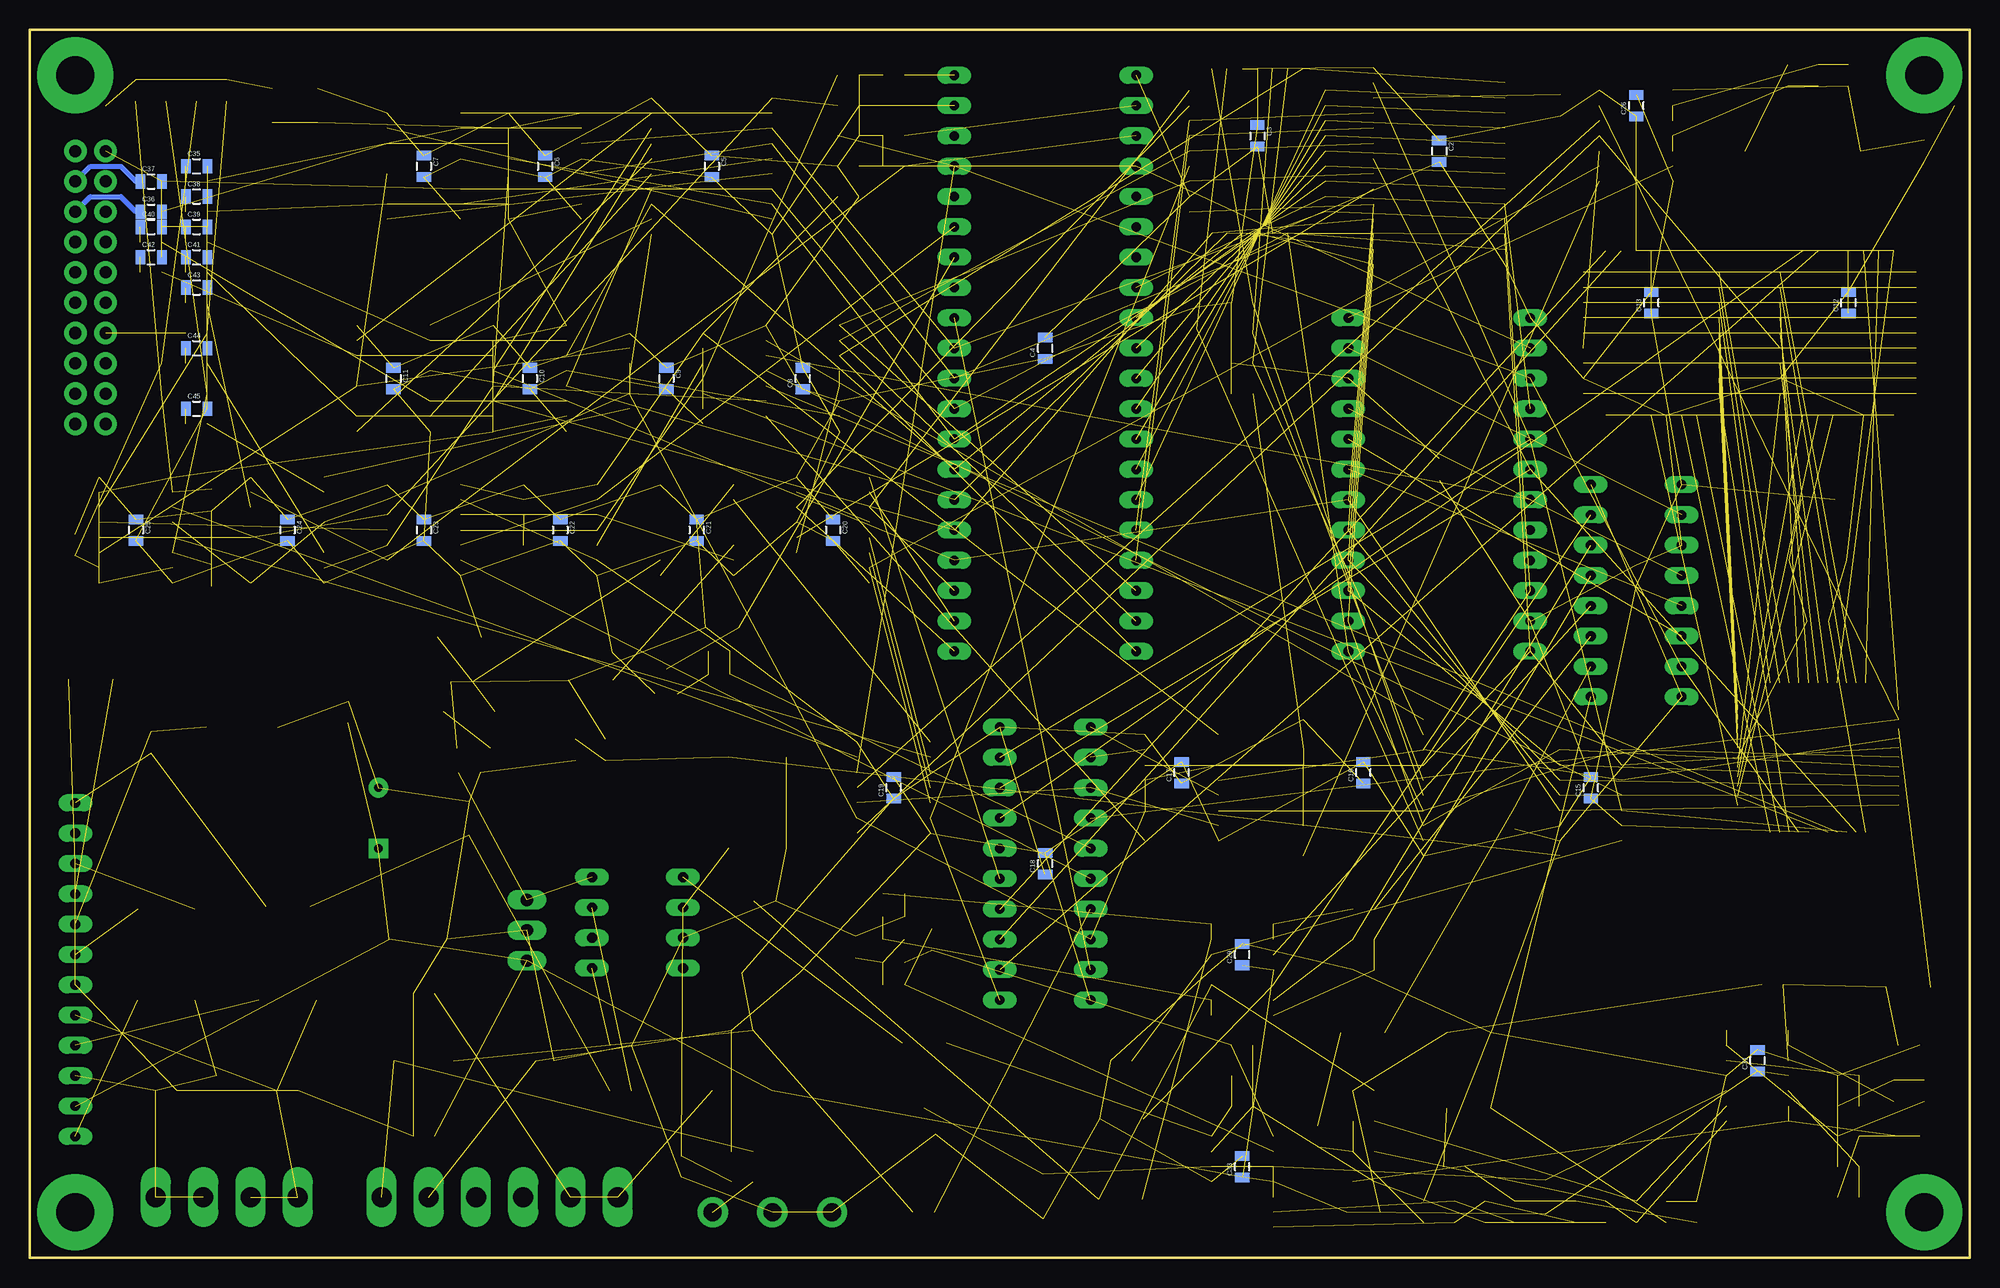
[diagram p5: board, bottom side, seen from below]

Size 162.56 x 102.87 mm. Coordinates in mm from the lower left corner, seen from the top.
Outline: 0,0 162.56,0 162.56,102.87 0,102.87 0,0
Copper layers (1*16): Top 0.035mm / dielectric 1.5mm / Bottom 0.035mm
Design rules "SparkFun": minimum track width 8mil, minimum drill 20mil, track to track 8mil, track to pad 8mil, pad to pad 8mil, via to via 8mil, smd to smd 8mil, copper to edge 10mil, drill to drill 8mil, minimum pad ring 12mil, minimum via ring 10mil, stop-mask expansion 4mil, vias tented up to drill 25mil, thermal gap 10mil

### Footprints (pad centres in the part's own frame; a part is rotated, then mirrored left to right if it is on the bottom)
0805 = smd 0.8 x 1.2: 1 -0.9,0; 2 0.9,0
PANASONIC_C = smd 2.2 x 0.65: + 1.9,-0.2; - -1.8,-0.2
PANASONIC_D = smd 3 x 1.4: + 2.4,0; - -2.4,0
PANASONIC_E = smd 3.8 x 1.4: + 3,0; - -3,0
CPOL-RADIAL-1000UF-25V = drill 0.7 pad 1.651 square: 1 2.54,0 | drill 0.7 pad 1.651: 2 -2.54,0
SMA-DIODE = smd 1.27 x 1.47: A -2.15,0; C 2.15,0
SOT23 = smd 1 x 1.4: 1 -0.95,-1.1; 2 0.95,-1.1; 3 0,1.1
NPI75C = smd 3 x 7.5: 1 -2.5,0; 2 2.5,0
STANDOFF-ELECTRICAL = drill 3.2 pad 6.35: P1 0,0
2X10_ROUND_NOSILK = drill 1.016 pad 1.88: 1 -11.43,-1.27; 2 -11.43,1.27; 3 -8.89,-1.27; 4 -8.89,1.27; 5 -6.35,-1.27; 6 -6.35,1.27; 7 -3.81,-1.27; 8 -3.81,1.27; 9 -1.27,-1.27; 10 -1.27,1.27; 11 1.27,-1.27; 12 1.27,1.27; 13 3.81,-1.27; 14 3.81,1.27; 15 6.35,-1.27; 16 6.35,1.27; 17 8.89,-1.27; 18 8.89,1.27; 19 11.43,-1.27; 20 11.43,1.27
1X6MTA = drill 1.676 long: 1 9.906,0; 2 5.944,0; 3 1.981,0; 4 -1.981,0; 5 -5.944,0; 6 -9.906,0
1X4MTA = drill 1.676 long: 1 5.944,0; 2 1.981,0; 3 -1.981,0; 4 -5.944,0
SOT23-3 = smd 0.8 x 0.9: 1 -0.95,-1; 2 0.95,-1; 3 0,1.1
1206 = smd 1.6 x 1.8: 1 -1.4,0; 2 1.4,0
R1206 = smd 1.6 x 1.803: 1 -1.422,0; 2 1.422,0
POT_ALPHA_RV16AF-20 = drill 1.5 pad 2.54: 1 -5,0; 2 0,0; 3 5,0
QFP44 = smd 0.4 x 2.2: 1 -4,-6.25; 2 -3.2,-6.25; 3 -2.4,-6.25; 4 -1.6,-6.25; 5 -0.8,-6.25; 6 0,-6.25; 7 0.8,-6.25; 8 1.6,-6.25; 9 2.4,-6.24; 10 3.2,-6.25; 11 4,-6.25; 23 4,6.25; 24 3.2,6.25; 25 2.4,6.26; 26 1.6,6.25; 27 0.8,6.25; 28 0,6.25; 29 -0.8,6.25; 30 -1.6,6.25; 31 -2.4,6.25; 32 -3.2,6.25; 33 -4,6.25 | smd 2.2 x 0.4: 12 6.75,-4; 13 6.75,-3.2; 14 6.75,-2.4; 15 6.75,-1.6; 16 6.75,-0.8; 17 6.75,0; 18 6.75,0.8; 19 6.75,1.6; 20 6.74,2.4; 21 6.75,3.2; 22 6.75,4; 34 -6.75,4; 35 -6.75,3.2; 36 -6.76,2.4; 37 -6.75,1.6; 38 -6.75,0.8; 39 -6.75,0; 40 -6.75,-0.8; 41 -6.75,-1.6; 42 -6.75,-2.4; 43 -6.75,-3.2; 44 -6.75,-4
SOP28 = smd 0.6 x 2.2: 1 -8.255,-5.5; 2 -6.985,-5.5; 3 -5.715,-5.5; 4 -4.445,-5.5; 5 -3.175,-5.5; 6 -1.905,-5.5; 7 -0.635,-5.5; 8 0.635,-5.5; 9 1.905,-5.5; 10 3.175,-5.5; 11 4.445,-5.5; 12 5.715,-5.5; 13 6.985,-5.5; 14 8.255,-5.5; 15 8.255,5.5; 16 6.985,5.5; 17 5.715,5.5; 18 4.445,5.5; 19 3.175,5.5; 20 1.905,5.5; 21 0.635,5.5; 22 -0.635,5.5; 23 -1.905,5.5; 24 -3.175,5.5; 25 -4.445,5.5; 26 -5.715,5.5; 27 -6.985,5.5; 28 -8.255,5.5
PLCC32R = smd 0.6 x 2.2: 1 0,6.9; 2 -1.27,6.9; 3 -2.54,6.9; 4 -3.81,6.9; 14 -3.81,-6.9; 15 -2.54,-6.9; 16 -1.27,-6.9; 17 0,-6.9; 18 1.27,-6.9; 19 2.54,-6.9; 20 3.81,-6.9; 30 3.81,6.9; 31 2.54,6.9; 32 1.27,6.9 | smd 2.2 x 0.6: 5 -5.7,5.08; 6 -5.7,3.81; 7 -5.7,2.54; 8 -5.7,1.27; 9 -5.7,0; 10 -5.7,-1.27; 11 -5.7,-2.54; 12 -5.7,-3.81; 13 -5.7,-5.08; 21 5.7,-5.08; 22 5.7,-3.81; 23 5.7,-2.54; 24 5.7,-1.27; 25 5.7,0; 26 5.7,1.27; 27 5.7,2.54; 28 5.7,3.81; 29 5.7,5.08
DIP40 = drill 0.813 long: 1 -24.13,-7.62; 2 -21.59,-7.62; 3 -19.05,-7.62; 4 -16.51,-7.62; 5 -13.97,-7.62; 6 -11.43,-7.62; 7 -8.89,-7.62; 8 -6.35,-7.62; 9 -3.81,-7.62; 10 -1.27,-7.62; 11 1.27,-7.62; 12 3.81,-7.62; 13 6.35,-7.62; 14 8.89,-7.62; 15 11.43,-7.62; 16 13.97,-7.62; 17 16.51,-7.62; 18 19.05,-7.62; 19 21.59,-7.62; 20 24.13,-7.62; 21 24.13,7.62; 22 21.59,7.62; 23 19.05,7.62; 24 16.51,7.62; 25 13.97,7.62; 26 11.43,7.62; 27 8.89,7.62; 28 6.35,7.62; 29 3.81,7.62; 30 1.27,7.62; 31 -1.27,7.62; 32 -3.81,7.62; 33 -6.35,7.62; 34 -8.89,7.62; 35 -11.43,7.62; 36 -13.97,7.62; 37 -16.51,7.62; 38 -19.05,7.62; 39 -21.59,7.62; 40 -24.13,7.62
SO20W = smd 0.66 x 2.032: 1 -5.715,-5.029; 2 -4.445,-5.029; 3 -3.175,-5.029; 4 -1.905,-5.029; 5 -0.635,-5.029; 6 0.635,-5.029; 7 1.905,-5.029; 8 3.175,-5.029; 9 4.445,-5.029; 10 5.715,-5.029; 11 5.715,5.029; 12 4.445,5.029; 13 3.175,5.029; 14 1.905,5.029; 15 0.635,5.029; 16 -0.635,5.029; 17 -1.905,5.029; 18 -3.175,5.029; 19 -4.445,5.029; 20 -5.715,5.029
SO16 = smd 0.66 x 2.032: 1 -4.445,-3.073; 2 -3.175,-3.073; 3 -1.905,-3.073; 4 -0.635,-3.073; 5 0.635,-3.073; 6 1.905,-3.073; 7 3.175,-3.073; 8 4.445,-3.073; 9 4.445,3.073; 10 3.175,3.073; 11 1.905,3.073; 12 0.635,3.073; 13 -0.635,3.073; 14 -1.905,3.073; 15 -3.175,3.073; 16 -4.445,3.073
SO14 = smd 0.66 x 2.032: 1 -3.81,-3.073; 2 -2.54,-3.073; 3 -1.27,-3.073; 4 0,-3.073; 5 1.27,-3.073; 6 2.54,-3.073; 7 3.81,-3.073; 8 3.81,3.073; 9 2.54,3.073; 10 1.27,3.073; 11 0,3.073; 12 -1.27,3.073; 13 -2.54,3.073; 14 -3.81,3.073
DIP24 = drill 0.813 long: 1 -13.97,-7.62; 2 -11.43,-7.62; 3 -8.89,-7.62; 4 -6.35,-7.62; 5 -3.81,-7.62; 6 -1.27,-7.62; 7 1.27,-7.62; 8 3.81,-7.62; 9 6.35,-7.62; 10 8.89,-7.62; 11 11.43,-7.62; 12 13.97,-7.62; 13 13.97,7.62; 14 11.43,7.62; 15 8.89,7.62; 16 6.35,7.62; 17 3.81,7.62; 18 1.27,7.62; 19 -1.27,7.62; 20 -3.81,7.62; 21 -6.35,7.62; 22 -8.89,7.62; 23 -11.43,7.62; 24 -13.97,7.62
SOIC16N = smd 0.6 x 2.2: 1 -4.445,-2.6; 2 -3.175,-2.6; 3 -1.905,-2.6; 4 -0.635,-2.6; 5 0.635,-2.6; 6 1.905,-2.6; 7 3.175,-2.6; 8 4.445,-2.6; 9 4.445,2.6; 10 3.175,2.6; 11 1.905,2.6; 12 0.635,2.6; 13 -0.635,2.6; 14 -1.905,2.6; 15 -3.175,2.6; 16 -4.445,2.6
DIP20N = drill 0.813 long: 1 -11.43,-3.81; 2 -8.89,-3.81; 3 -6.35,-3.81; 4 -3.81,-3.81; 5 -1.27,-3.81; 6 1.27,-3.81; 7 3.81,-3.81; 8 6.35,-3.81; 9 8.89,-3.81; 10 11.43,-3.81; 11 11.43,3.81; 12 8.89,3.81; 13 6.35,3.81; 14 3.81,3.81; 15 1.27,3.81; 16 -1.27,3.81; 17 -3.81,3.81; 18 -6.35,3.81; 19 -8.89,3.81; 20 -11.43,3.81
DIP16N = drill 0.813 long: 1 -8.89,-3.81; 2 -6.35,-3.81; 3 -3.81,-3.81; 4 -1.27,-3.81; 5 1.27,-3.81; 6 3.81,-3.81; 7 6.35,-3.81; 8 8.89,-3.81; 9 8.89,3.81; 10 6.35,3.81; 11 3.81,3.81; 12 1.27,3.81; 13 -1.27,3.81; 14 -3.81,3.81; 15 -6.35,3.81; 16 -8.89,3.81
SO14' = smd 0.6 x 2.2: 1 -3.81,-2.6; 2 -2.54,-2.6; 3 -1.27,-2.6; 4 0,-2.6; 5 1.27,-2.6; 6 2.54,-2.6; 7 3.81,-2.6; 8 3.81,2.6; 9 2.54,2.6; 10 1.27,2.6; 11 0,2.6; 12 -1.27,2.6; 13 -2.54,2.6; 14 -3.81,2.6
MC3340 = drill 0.813 long: 1 -3.81,-3.81; 2 -1.27,-3.81; 3 1.27,-3.81; 4 3.81,-3.81; 5 3.81,3.81; 6 1.27,3.81; 7 -1.27,3.81; 8 -3.81,3.81
SIP12 = drill 0.813 long: 1 -10.16,0; 2 -7.62,0; 3 -5.08,0; 4 -2.54,0; 5 0,0; 6 2.54,0; 7 5.08,0; 8 7.62,0; 9 10.16,0; 10 12.7,0; 11 15.24,0; 12 17.78,0
7809-TO220V = drill 1.016 long: 1 -2.54,-2.54; 2 0,-2.54; 3 2.54,-2.54
SJ = smd 1.168 x 1.6: 1 -0.762,0; 2 0.762,0
HC49UP = smd 5.334 x 1.93: 1 -4.826,0; 2 4.826,0
CRYSTAL-OSC-SMD-5X3 = smd 1.9 x 1.1: 1 -1.85,-1.15; 2 1.85,-1.15; 3 1.85,1.15; 4 -1.85,1.15

### Placement (x,y rotation side)
C2  44.45,92.71 270 bottom
C3  59.69,93.98 270 bottom
C4  77.47,76.2 90 bottom
C5  105.41,91.44 270 bottom
C6  119.38,91.44 270 bottom
C7  129.54,91.44 270 bottom
C8  97.79,73.66 90 bottom
C9  109.22,73.66 270 bottom
C10  120.65,73.66 270 bottom
C11  132.08,73.66 270 bottom
C12  10.16,80.01 90 bottom
C13  26.67,80.01 90 bottom
C14  44.45,66.04 270 top
C15  31.75,39.37 90 bottom
C16  50.8,40.64 90 bottom
C17  66.04,40.64 90 bottom
C18  77.47,33.02 90 bottom
C19  90.17,39.37 90 bottom
C20  95.25,60.96 270 bottom
C21  106.68,60.96 270 bottom
C22  118.11,60.96 270 bottom
C23  129.54,60.96 270 bottom
C24  140.97,60.96 270 bottom
C25  153.67,60.96 270 bottom
C26  27.94,96.52 90 bottom
C28  27.94,57.15 90 top
C29  60.96,25.4 90 bottom
C31  17.78,16.51 90 bottom
C32  135.89,45.72 270 top
C33  60.96,7.62 90 bottom
C35  148.59,91.44 0 bottom
C36  152.4,87.63 0 bottom
C37  152.4,90.17 0 bottom
C38  148.59,88.9 0 bottom
C39  148.59,86.36 0 bottom
C40  152.4,86.36 0 bottom
C41  148.59,83.82 0 bottom
C42  152.4,83.82 0 bottom
C43  148.59,81.28 0 bottom
C44  148.59,76.2 0 bottom
C45  148.59,71.12 0 bottom
C46  5.08,22.86 0 top
C47  15.24,99.06 270 top
C48  10.16,7.62 0 top
C49  3.81,92.71 270 top
C50  10.16,15.24 0 top
C51  25.4,3.81 90 top
C52  3.81,13.97 90 top
C53  41.91,12.7 0 top
C54  45.72,3.81 90 top
C55  50.8,26.67 180 top
C56  38.1,36.83 270 top
C57  50.8,19.05 0 top
C58  5.08,10.16 180 top
C59  27.94,3.81 90 top
C60  43.18,3.81 90 top
C61  22.86,3.81 90 top
C62  104.78,48.9 0 top
C63  101.6,41.91 0 top
C64  71.12,11.43 180 top
C65  125.73,40.64 0 top
C66  101.6,34.29 0 top
C67  71.12,5.08 0 top
C68  87.63,17.78 180 top
C69  93.34,26.04 90 top
C70  100.46,23.88 0 top
C71  87,26.67 90 top
C72  102.87,19.05 0 top
C73  77.47,5.08 90 top
C74  102.87,8.89 0 top
C76  113.03,17.78 180 top
C80  151.13,29.21 0 top
C81  140.97,29.21 180 top
C83  157.48,48.26 180 top
C84  144.78,44.45 0 top
C85  130.05,26.67 0 top
C86  140.97,21.59 0 top
C87  151.13,21.59 0 top
C88  129.54,22.1 0 top
C89  129.54,10.16 0 top
C90  140.97,13.97 0 top
C91  151.13,13.97 0 top
C92  146.05,15.24 180 top
C95  133.35,36.83 270 top
C96  60.96,15.24 0 top
C97  107.95,7.62 90 top
C98  71.12,16.51 0 top
C99  12.7,53.34 180 top
C100  126.49,52.2 0 top
C102  41.91,19.05 0 top
C103  12.7,58.42 0 top
C104  146.05,97.79 270 top
C105  148.59,97.79 270 top
C106  151.13,97.79 90 top
C107  153.67,97.79 90 top
CR1  125.73,45.72 0 top
CR2  87.63,11.43 0 top
L1  129.54,16.51 0 top
L2  102.87,13.97 180 top
MTG1  158.75,3.81 0 top
MTG2  3.81,3.81 0 top
MTG3  158.75,99.06 0 top
MTG4  3.81,99.06 0 top
P1  157.48,81.28 270 top
P6  123.19,5.08 0 top
P7  146.05,5.08 0 top
Q1  109.22,48.26 0 top
R1  34.29,96.52 270 top
R2  90.17,93.98 0 top
R3  93.98,93.98 180 top
R4  93.98,96.52 180 top
R5  90.17,91.44 0 top
R6  90.17,99.06 0 top
R7  93.98,91.44 0 top
R9  93.98,88.9 180 top
R10  93.98,99.06 180 top
R11  148.59,90.17 0 top
R12  152.4,87.63 0 top
R13  152.4,90.17 0 top
R14  148.59,87.63 0 top
R15  47  [0805]  148.59,85.09 0 top
R16  47  [0805]  152.4,85.09 0 top
R17  47  [0805]  148.59,82.55 0 top
R18  47  [0805]  152.4,82.55 0 top
R19  148.59,80.01 0 top
R20  148.59,74.93 0 top
R21  148.59,69.85 0 top
R22  60.96,80.01 0 top
R23  60.96,77.47 0 top
R24  60.96,74.93 0 top
R25  60.96,72.39 0 top
R26  64.77,78.74 90 top
R27  104.52,52.83 0 top
R28  104.78,50.8 0 top
R29  126.36,48.26 0 top
R30  125.35,42.67 0 top
R32  10.16,99.06 90 top
R33  5.08,17.78 0 top
R34  12.7,99.06 270 top
R35  10.16,10.16 0 top
R36  10.16,5.08 0 top
R38  10.16,12.7 0 top
R39  6.35,13.97 270 top
R40  43.18,7.62 0 top
R41  50.8,24.13 180 top
R43  50.8,29.21 180 top
R44  54.61,10.16 90 top
R45  50.8,8.89 0 top
R46  50.8,11.43 0 top
R48  16.51,22.86 0 top
R51  33.02,3.81 90 top
R52  38.1,3.81 90 top
R54  35.56,5.08 90 top
R55  50.8,13.97 0 top
R59  90.17,30.48 0 top
R60  100.97,29.84 0 top
R61  90.17,28.57 0 top
R62  90.17,26.67 0 top
R63  90.17,24.77 0 top
R64  90.17,22.86 0 top
R68  116.84,42.55 90 top
R69  114.3,42.55 90 top
R70  125.73,36.83 90 top
R71  113.03,13.97 0 top
R77  40.64,3.81 90 top
R78  30.48,3.81 90 top
R79  60.96,17.78 0 top
R81  50.8,6.35 0 top
R82  138.43,96.52 90 top
R83  142.24,96.52 270 top
R84  147.32,63.5 270 top
R85  147.32,57.15 270 top
R86  158.75,59.69 90 top
R87  102.87,6.35 180 top
R88  60.96,12.7 180 top
R89  12.7,63.5 180 top
R90  50.8,3.81 0 top
R91  87.63,3.81 0 top
R92  152.4,43.18 90 top
R93  148.59,72.39 0 top
R94  152.4,72.39 0 top
R95  152.4,74.93 0 top
R96  148.59,77.47 0 top
RV1  100.33,3.81 0 top
U1  12.7,41.91 0 top
U2  44.45,91.44 270 top
U3  59.69,92.71 0 top
U4  77.47,74.93 270 top
U5  105.41,91.44 270 top
U6  119.38,91.44 270 top
U7  129.54,91.44 270 top
U8  97.79,73.66 270 top
U9  109.22,73.66 270 top
U10  120.65,73.66 270 top
U11  132.08,73.66 270 top
U12  10.16,77.47 0 top
U13  26.67,77.47 0 top
U14  44.45,64.77 270 top
U15  31.75,38.1 90 top
U16  50.8,39.37 270 top
U17  66.04,39.37 270 top
U18  77.47,33.02 270 top
U19  90.17,39.37 270 top
U20  95.25,60.96 270 top
U21  106.68,60.96 270 top
U22  118.11,60.96 270 top
U23  129.54,60.96 270 top
U24  140.97,60.96 270 top
U25  153.67,60.96 270 top
U26  27.94,93.98 270 top
U28  27.94,55.88 270 top
U29  LM324D  [SO14']  60.96,24.13 270 top
U30  111.63,28.07 270 top
U31  158.75,27.94 270 top
U32  TL084D  [SO14']  17.78,15.24 270 top
U33  TL084D  [SO14']  60.96,6.35 270 top
VR1  118.36,27.43 90 top
W8  119.38,16.51 180 top
Y1  3.5749MHz  [HC49UP]  13.97,92.71 0 top
Y2  115.57,49.53 180 top

### Tracks (layer width: path | path; a pad name or v marks a point on that pad's centre or on a via)
5V  (82 unrouted)
12V  (14 unrouted)
+9V  (2 unrouted)
+12VDEC  (3 unrouted)
/E  (4 unrouted)
/EORQ  (1 unrouted)
/Q  (1 unrouted)
/RD  (3 unrouted)
/WR  (4 unrouted)
A0  (3 unrouted)
A1  (2 unrouted)
A2  (2 unrouted)
A3  (2 unrouted)
A4  (2 unrouted)
A5  (2 unrouted)
A6  (2 unrouted)
A7  (2 unrouted)
A8  (2 unrouted)
A9  (2 unrouted)
A10  (3 unrouted)
A11  (3 unrouted)
A12  (3 unrouted)
A13  (2 unrouted)
A14  (1 unrouted)
A15  (2 unrouted)
ADPCM  (1 unrouted)
ADPCMCLK  (1 unrouted)
AGND  (49 unrouted)
ATE1  (15 unrouted)
ATE_CLR  (5 unrouted)
B_SND_RD  (1 unrouted)
  Top 0.254: P1.15 154.94,74.93 153.67,73.66 150.76,73.66 R20.2
B_VIDDAV  (2 unrouted)
B_VIDRES  (3 unrouted)
BS0  (1 unrouted)
BS1  (1 unrouted)
BS2  (2 unrouted)
D0  (9 unrouted)
D1  (9 unrouted)
D2  (9 unrouted)
D3  (8 unrouted)
D4  (7 unrouted)
D5  (7 unrouted)
D6  (7 unrouted)
D7  (7 unrouted)
DAC  (1 unrouted)
DAC-OUT  (3 unrouted)
FFO  (1 unrouted)
FIRQ  (2 unrouted)
GND  (91 unrouted)
  Top 0.406: MTG3.P1 156.21,101.6 6.35,101.6 MTG4.P1 1.27,96.52 1.27,6.35 MTG2.P1 6.35,1.27 156.21,1.27 MTG1.P1 161.29,6.35 161.29,96.52 MTG3.P1 | MTG3.P1 156.21,96.52 P1.1
IRQ  (3 unrouted)
N$1  (1 unrouted)
N$2  (2 unrouted)
N$3  (2 unrouted)
N$4  (1 unrouted)
N$5  (2 unrouted)
N$6  (1 unrouted)
N$7  (2 unrouted)
N$8  (6 unrouted)
N$9  (1 unrouted)
N$10  (1 unrouted)
N$11  (1 unrouted)
N$12  (2 unrouted)
N$13  (1 unrouted)
N$14  (3 unrouted)
N$15  (1 unrouted)
N$16  (1 unrouted)
N$17  (1 unrouted)
N$18  (2 unrouted)
N$19  (1 unrouted)
N$20  (1 unrouted)
N$21  (1 unrouted)
N$22  (1 unrouted)
N$23  (1 unrouted)
N$24  (2 unrouted)
N$25  (2 unrouted)
N$26  (2 unrouted)
N$27  (2 unrouted)
N$28  (6 unrouted)
N$29  (2 unrouted)
N$30  (1 unrouted)
N$31  (2 unrouted)
N$32  (1 unrouted)
N$34  (3 unrouted)
N$35  (3 unrouted)
N$36  (3 unrouted)
N$37  (1 unrouted)
N$38  (1 unrouted)
N$40  (1 unrouted)
N$41  (1 unrouted)
N$42  (1 unrouted)
N$43  (1 unrouted)
N$44  (3 unrouted)
N$45  (1 unrouted)
N$46  (2 unrouted)
N$47  (1 unrouted)
N$48  (1 unrouted)
N$49  (2 unrouted)
N$50  (2 unrouted)
N$51  (2 unrouted)
N$52  (1 unrouted)
N$53  (1 unrouted)
N$54  (3 unrouted)
N$55  (2 unrouted)
N$56  (3 unrouted)
N$57  (2 unrouted)
N$58  (2 unrouted)
N$59  (3 unrouted)
N$60  (3 unrouted)
N$61  (3 unrouted)
N$62  (2 unrouted)
N$63  (2 unrouted)
N$64  (3 unrouted)
N$65  (2 unrouted)
N$66  (2 unrouted)
N$67  (2 unrouted)
N$68  (3 unrouted)
N$69  (2 unrouted)
N$70  (3 unrouted)
N$71  (3 unrouted)
N$72  (3 unrouted)
N$73  (2 unrouted)
N$74  (6 unrouted)
N$78  (3 unrouted)
N$79  (3 unrouted)
N$80  (2 unrouted)
N$81  (3 unrouted)
N$83  (3 unrouted)
N$86  (3 unrouted)
N$87  (1 unrouted)
N$88  (1 unrouted)
N$89  (2 unrouted)
N$90  (1 unrouted)
N$91  (2 unrouted)
N$92  (2 unrouted)
N$93  (1 unrouted)
N$94  (1 unrouted)
N$95  (1 unrouted)
N$96  (1 unrouted)
N$97  (1 unrouted)
N$98  (1 unrouted)
N$99
  Top 0.254: P1.16 157.48,76.2 154.57,76.2 R95.2
N$100  (5 unrouted)
N$101
  Top 0.254: P1.17 154.94,72.39 153.67,71.12 150.76,71.12 R93.2
N$102
  Top 0.254: P1.18 157.48,73.66 154.57,73.66 R94.2
N$103  (5 unrouted)
N$104  (1 unrouted)
N$105  (1 unrouted)
N$106  (1 unrouted)
N$107  (1 unrouted)
N$108  (1 unrouted)
N$109  (1 unrouted)
N$110  (1 unrouted)
N$111  (1 unrouted)
N$112  (2 unrouted)
N$113  (1 unrouted)
N$114  (4 unrouted)
N$115  (2 unrouted)
N$116  (2 unrouted)
N$117  (2 unrouted)
N$118  (2 unrouted)
N$119  (2 unrouted)
N$120  (13 unrouted)
N$122  (2 unrouted)
N$123  (2 unrouted)
N$127  (1 unrouted)
N$128  (1 unrouted)
PCM-A0  (2 unrouted)
PCM-A1  (2 unrouted)
PCM-A2  (2 unrouted)
PCM-A3  (2 unrouted)
PCM-A4  (2 unrouted)
PCM-A5  (2 unrouted)
PCM-A6  (2 unrouted)
PCM-A7  (2 unrouted)
PCM-A8  (2 unrouted)
PCM-A9  (2 unrouted)
PCM-A10  (2 unrouted)
PCM-A11  (2 unrouted)
PCM-A12  (2 unrouted)
PCM-A13  (2 unrouted)
PCM-A14  (2 unrouted)
PCM-A15  (2 unrouted)
PCM-A16  (2 unrouted)
PCM-A17  (2 unrouted)
PCM-BS  (1 unrouted)
PCM-D0  (2 unrouted)
PCM-D1  (2 unrouted)
PCM-D2  (2 unrouted)
PCM-D3  (3 unrouted)
PCM-D4  (1 unrouted)
PCM-D5  (2 unrouted)
PCM-D6  (2 unrouted)
PCM-D7  (2 unrouted)
PCM-OUT  (3 unrouted)
R/W  (1 unrouted)
RA17-0  (1 unrouted)
RA17-1  (1 unrouted)
RA18-0  (1 unrouted)
RA18-1  (1 unrouted)
RD-LATCH  (4 unrouted)
RESET  (5 unrouted)
SND_DAT0  (1 unrouted)
  Top 0.254: P1.3 154.94,90.17 153.67,88.9 150.76,88.9 R11.2
SND_DAT1
  Top 0.254: P1.4 157.48,91.44 154.94,91.44 153.67,90.17 R13.2
  Bottom 0.406: P1.4 157.48,91.44 154.94,91.44 153.67,90.17 R13.2
SND_DAT2  (1 unrouted)
  Top 0.254: P1.5 154.94,87.63 153.67,86.36 150.76,86.36 R14.2
SND_DAT3
  Top 0.254: P1.6 157.48,88.9 154.94,88.9 153.67,87.63 R12.2
  Bottom 0.406: P1.6 157.48,88.9 154.94,88.9 153.67,87.63 R12.2
SND_DAT4  (1 unrouted)
  Top 0.254: P1.7 154.94,85.09 153.67,83.82 150.76,83.82 R15.2
SND_DAT5  (1 unrouted)
  Top 0.254: P1.8 157.48,86.36 154.94,86.36 153.67,85.09 R16.2
SND_DAT6  (1 unrouted)
  Top 0.254: P1.9 154.94,82.55 153.67,81.28 150.76,81.28 R17.2
SND_DAT7  (1 unrouted)
  Top 0.254: P1.10 157.48,83.82 154.94,83.82 153.67,82.55 R18.2
SND_DAT8  (3 unrouted)
SND_DAV  (1 unrouted)
  Top 0.254: P1.19 R21.2
SND_RDY  (1 unrouted)
  Top 0.254: P1.11 R19.2
SNDVIDRD  (3 unrouted)
SOFT_RES  (1 unrouted)
VIDPWRON  (1 unrouted)
VIDSNDRD  (3 unrouted)
WR-LATCH  (2 unrouted)
YAM  (1 unrouted)
YAM1-OUT  (1 unrouted)
YAM2-OUT  (1 unrouted)